# EAGLE board M8341D (EAGLE 6.6.0), part 1 of 2
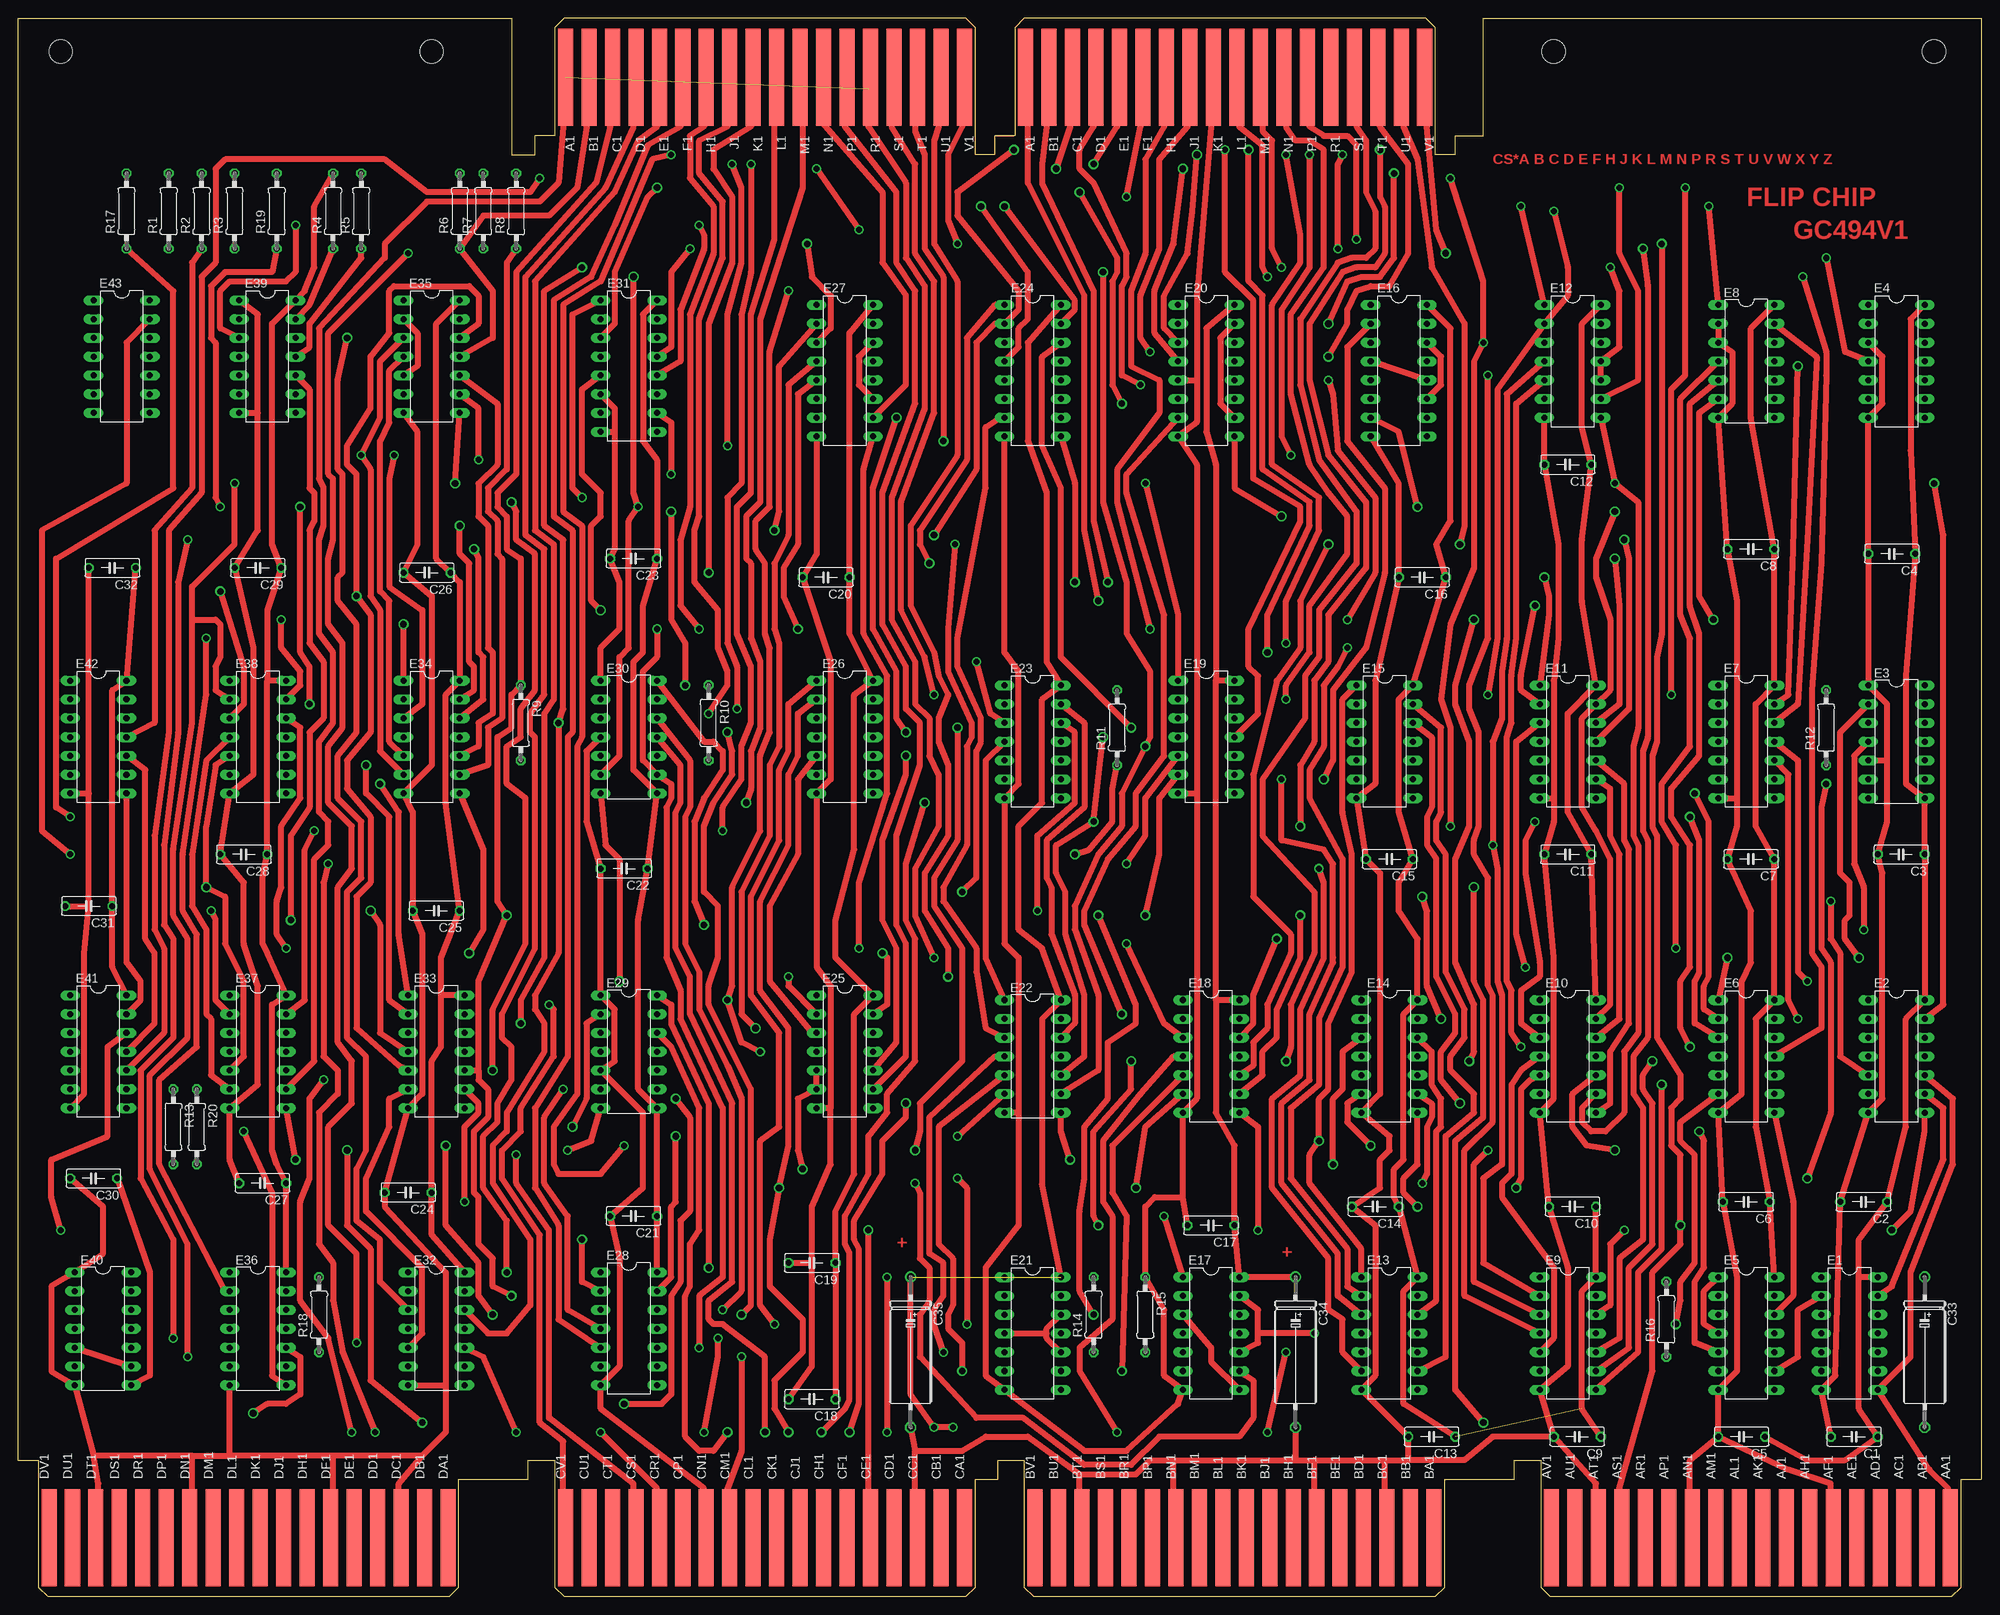
[diagram p4: board, top side]
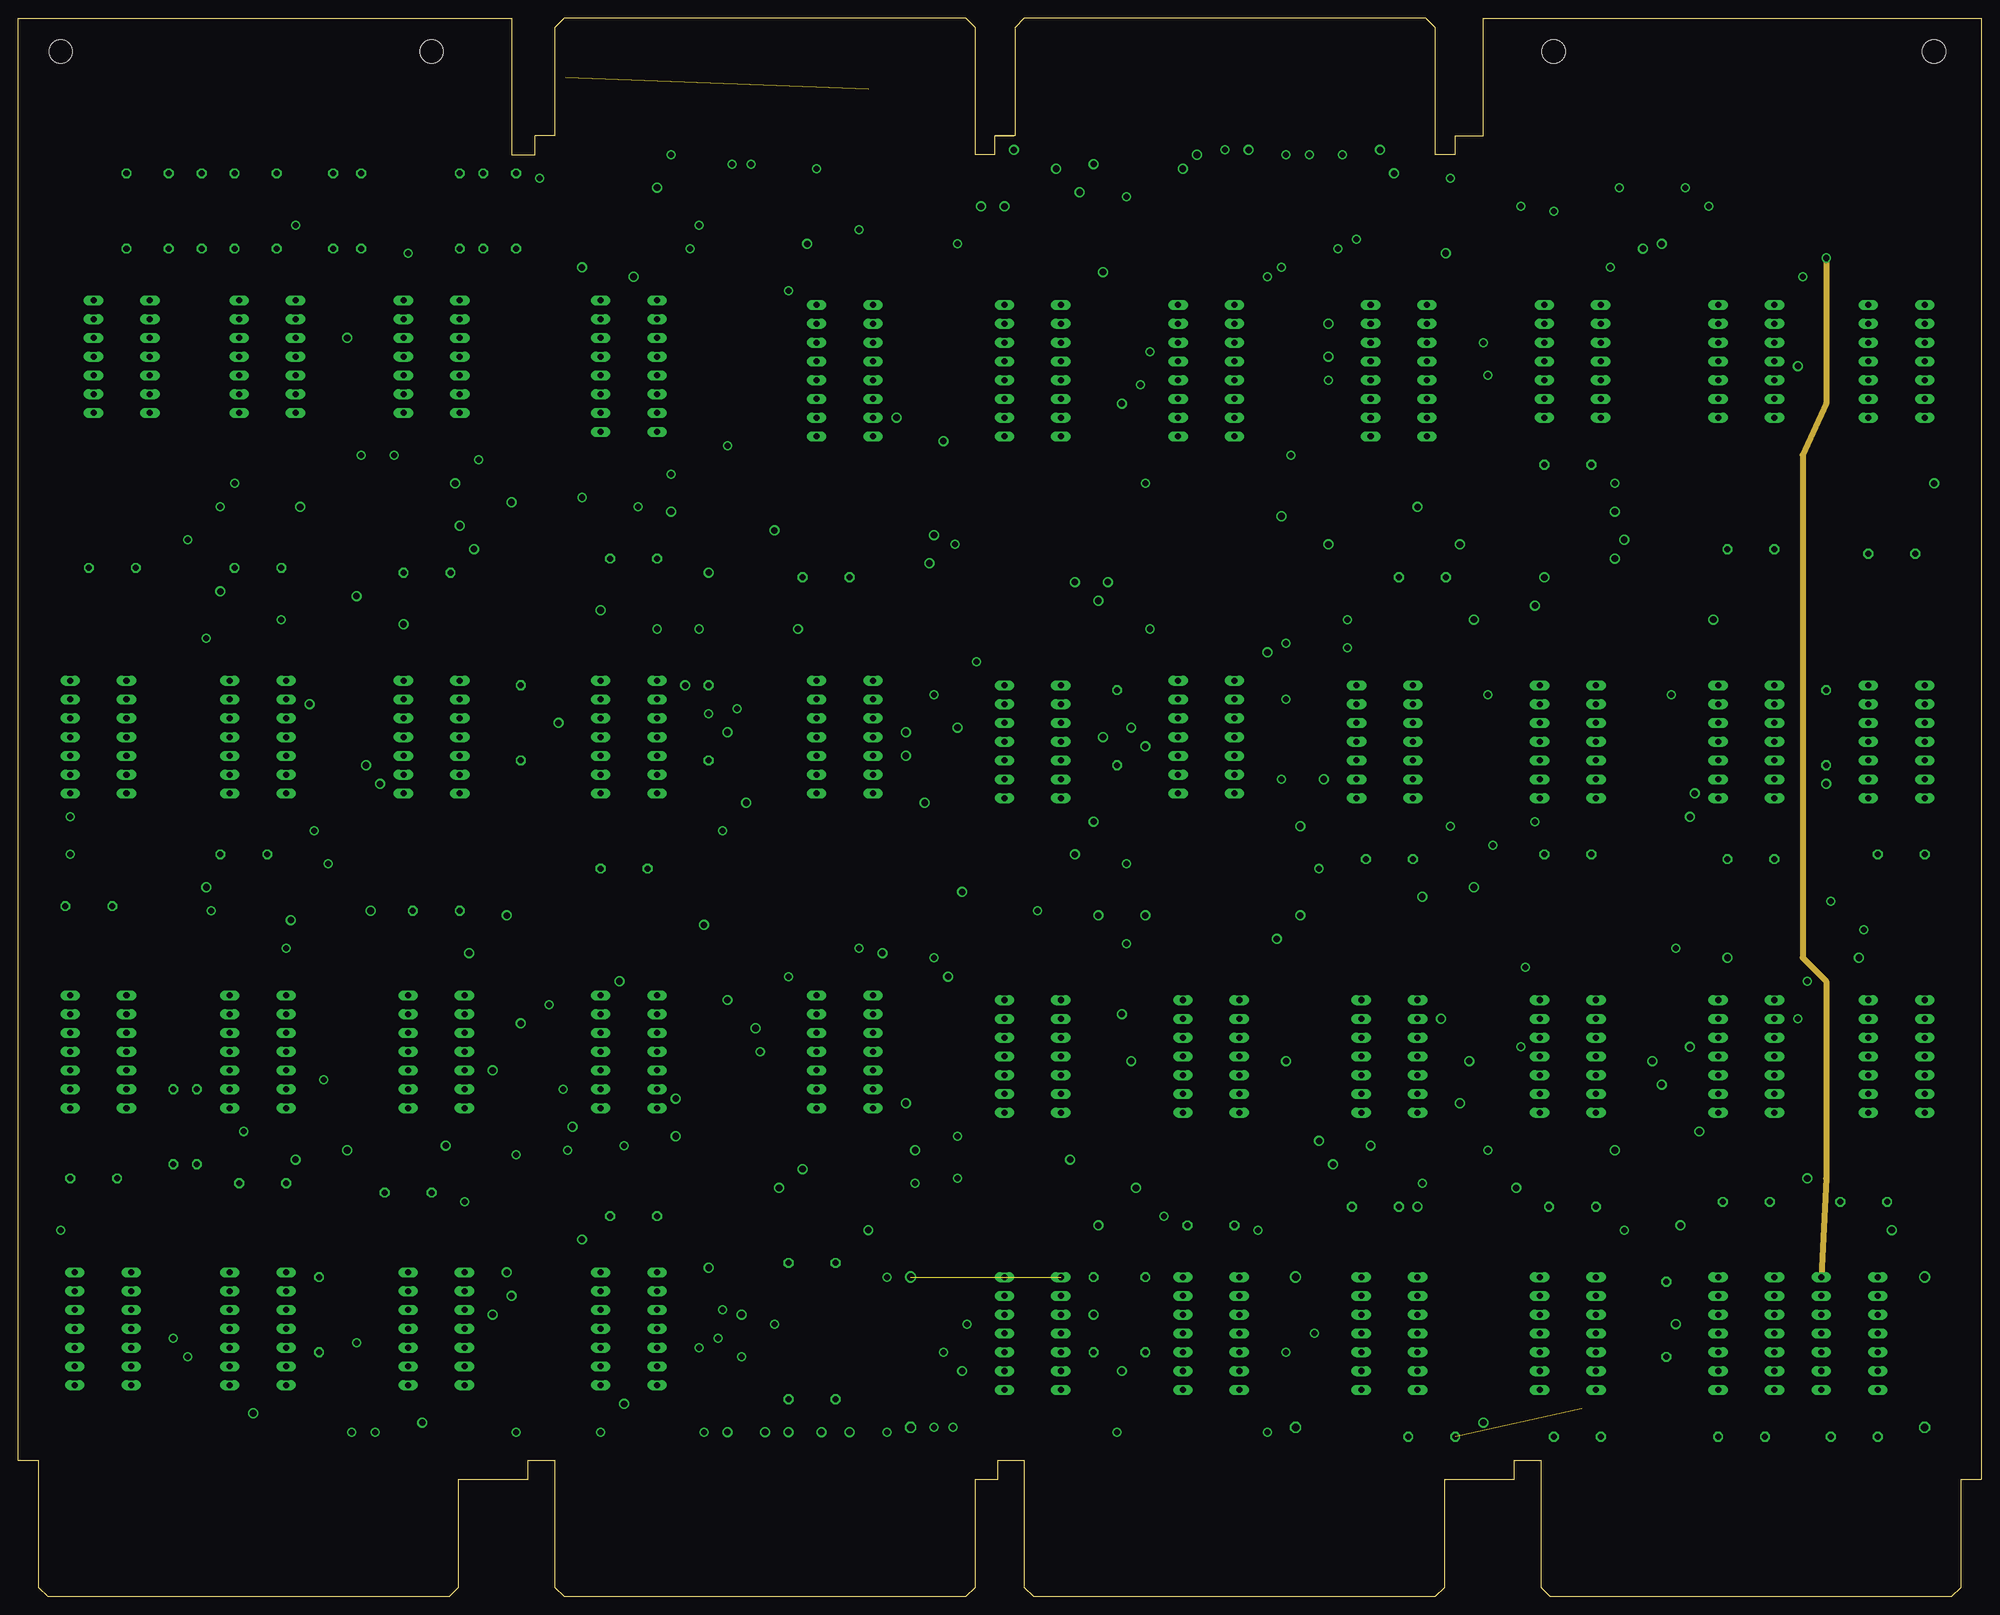
[diagram p5: board, inner layer ECO]
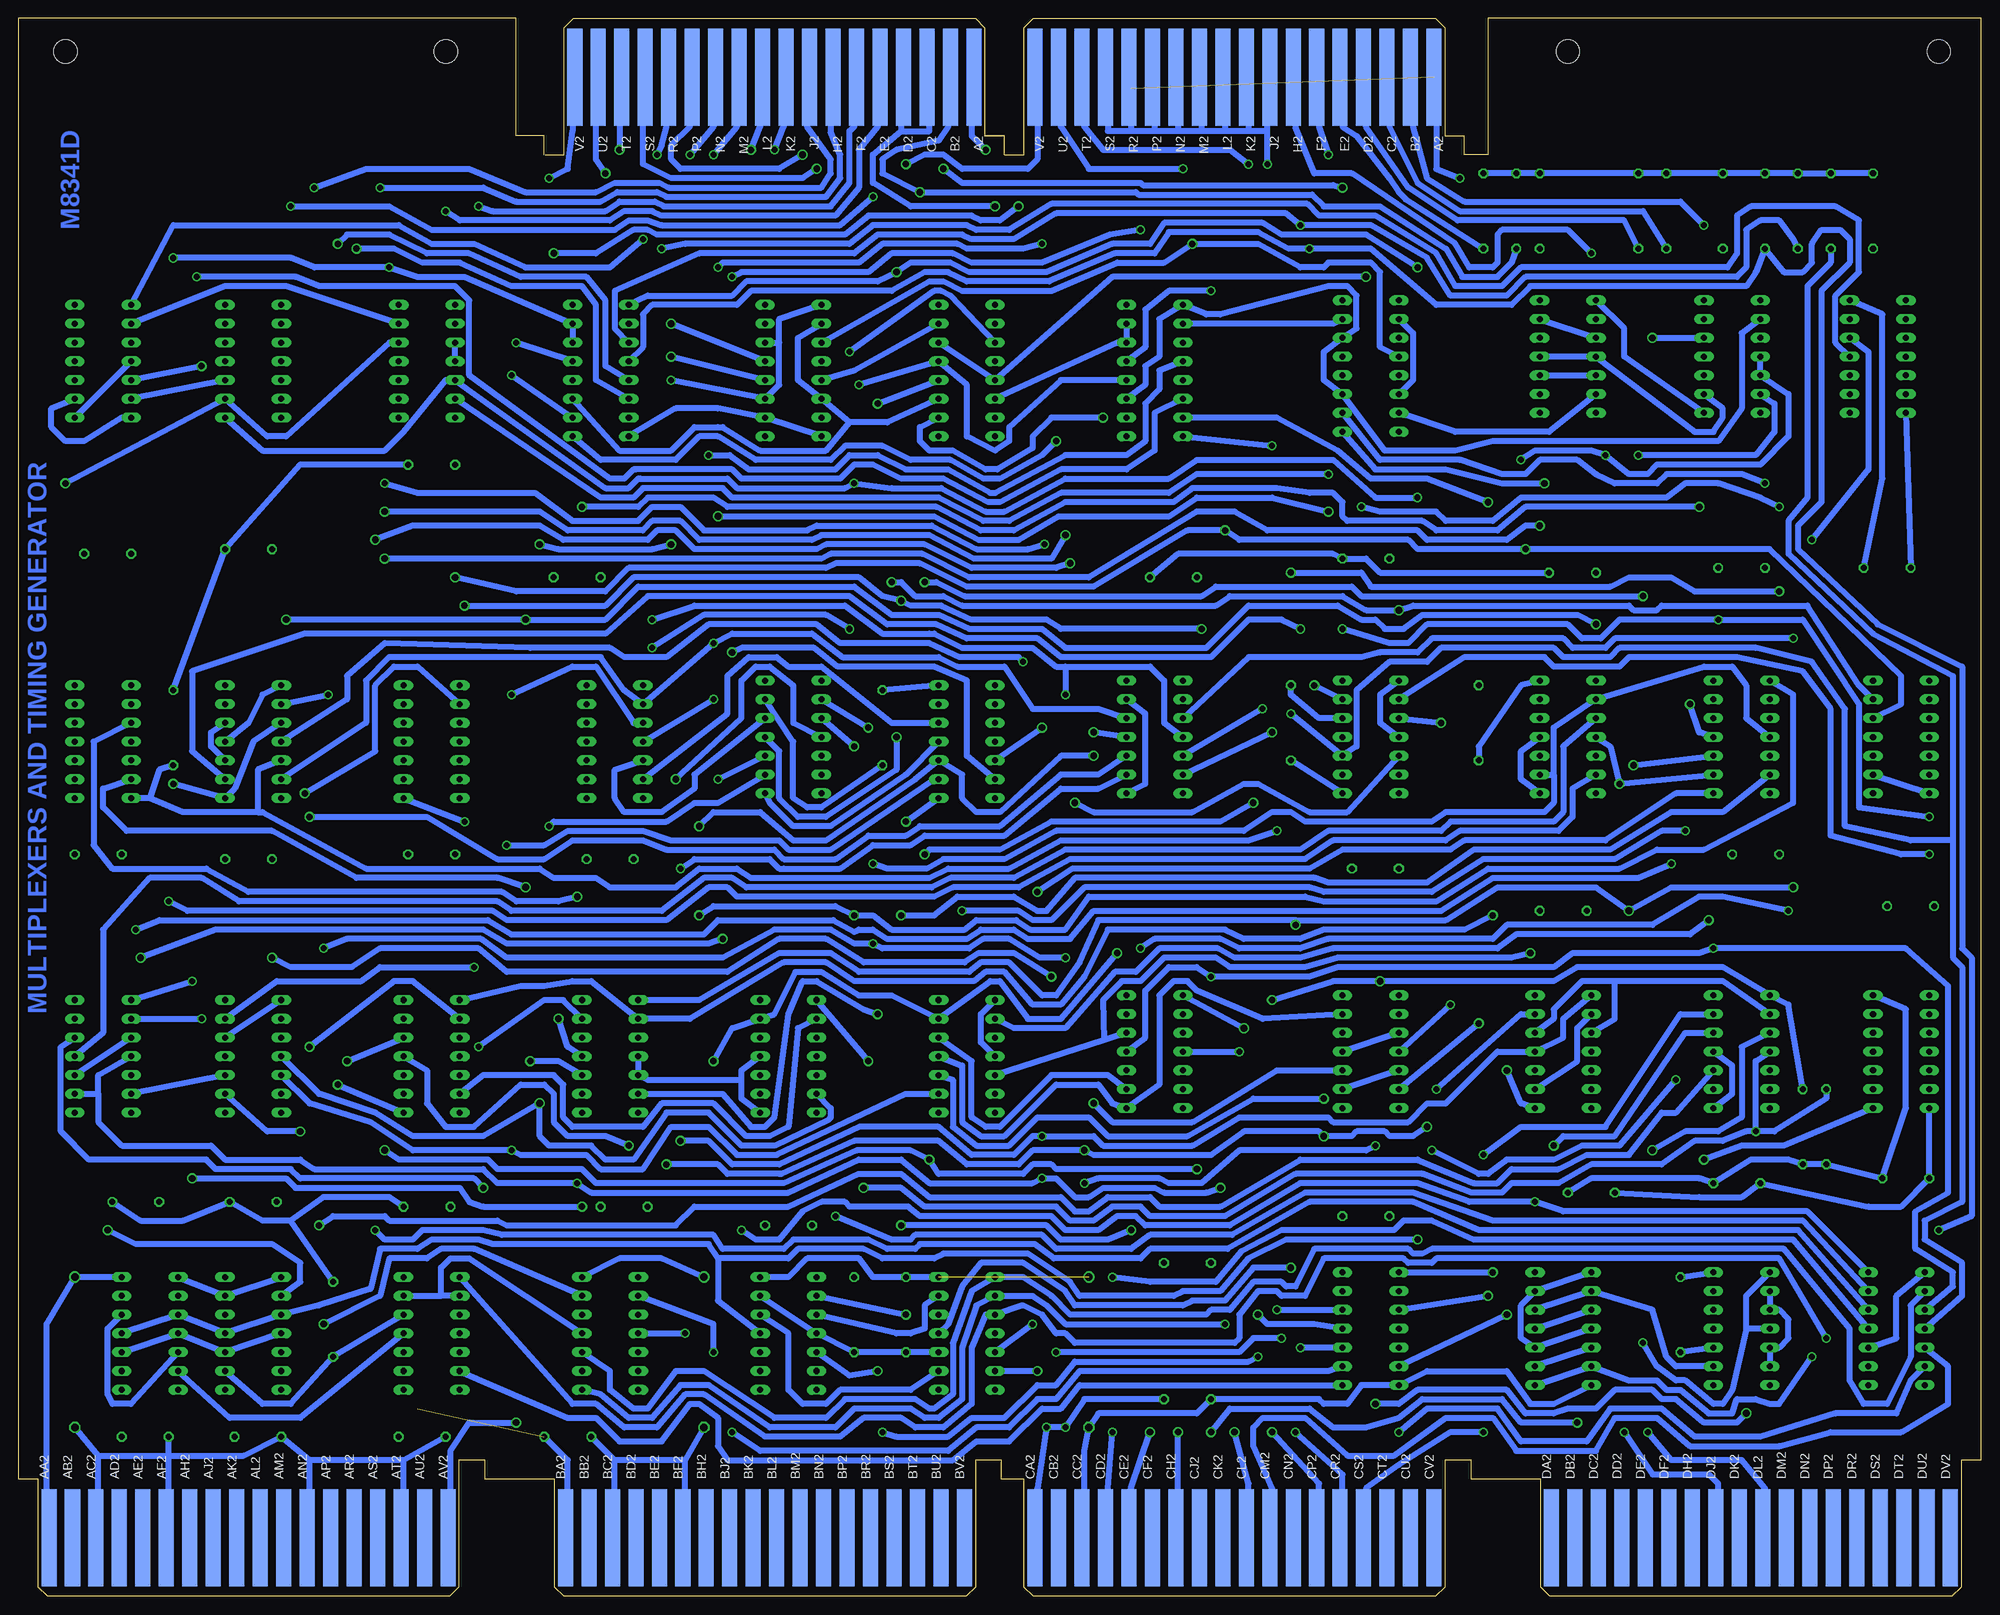
[diagram p6: board, bottom side, seen from below]

Size 265.43 x 213.36 mm. Coordinates in mm from the lower left corner, seen from the top.
Outline: 69.85,197.49 69.85,194.94 66.67,194.94 66.67,213.36 0,213.36 0,18.41 0.64,18.41
Outline: 265.43,15.88 265.43,213.36 198.12,213.36 198.12,197.49 194.31,197.49 194.31,194.94
Outline: 131.76,194.94 132.08,194.94 132.08,197.49 134.62,197.49
Copper layers (1+2+16): Top 0.035mm / dielectric 1.5mm / ECO 0.035mm / dielectric 0.15mm / Bottom 0.035mm
Design rules "16mils *": minimum track width 16mil, minimum drill 32mil, track to track 15mil, track to pad 10mil, pad to pad 10mil, via to via 10mil, smd to smd 10mil, copper to edge 13mil, drill to drill 10mil, minimum pad ring 10mil, minimum via ring 8mil, stop-mask expansion 0mil, vias tented up to drill 0mil, thermal gap 10mil
Net classes: 1 supply: width 0.813 mm
Holes 3.2 mm at 5.71,208.91 55.88,208.91 207.65,208.91 259.08,208.91

## Footprints (pad centres in the part's own frame; a part is rotated, then mirrored left to right if it is on the bottom)
C063-025X075 = drill 0.813 octagon: 1 -2.54,0; 2 3.81,0
E12-8 = drill 1.016: + -10.16,0 | drill 1.016 octagon: - 10.16,0
DIL14 = drill 0.813 long: 1 -7.62,-3.81; 2 -5.08,-3.81; 3 -2.54,-3.81; 4 0,-3.81; 5 2.54,-3.81; 6 5.08,-3.81; 7 7.62,-3.81; 8 7.62,3.81; 9 5.08,3.81; 10 2.54,3.81; 11 0,3.81; 12 -2.54,3.81; 13 -5.08,3.81; 14 -7.62,3.81
DIL16 = drill 0.813 long: 1 -8.89,-3.81; 2 -6.35,-3.81; 3 -3.81,-3.81; 4 -1.27,-3.81; 5 1.27,-3.81; 6 3.81,-3.81; 7 6.35,-3.81; 8 8.89,-3.81; 9 8.89,3.81; 10 6.35,3.81; 11 3.81,3.81; 12 1.27,3.81; 13 -1.27,3.81; 14 -3.81,3.81; 15 -6.35,3.81; 16 -8.89,3.81
EDGE-CON2 = smd 13.106 x 2.032: A1 7.938,4.128; B1 7.938,7.303; C1 7.938,10.477; D1 7.938,13.652; E1 7.938,16.828; F1 7.938,20.003; H1 7.938,23.177; J1 7.938,26.352; K1 7.938,29.527; L1 7.938,32.703; M1 7.938,35.877; N1 7.938,39.053; P1 7.938,42.227; R1 7.938,45.403; S1 7.938,48.578; T1 7.938,51.752; U1 7.938,54.928; V1 7.938,58.102 | smd 13.106 x 2.032 bottom: A2 7.938,4.128; B2 7.938,7.303; C2 7.938,10.477; D2 7.938,13.652; E2 7.938,16.828; F2 7.938,20.003; H2 7.938,23.177; J2 7.938,26.352; K2 7.938,29.527; L2 7.938,32.703; M2 7.938,35.877; N2 7.938,39.053; P2 7.938,42.227; R2 7.938,45.403; S2 7.938,48.578; T2 7.938,51.752; U2 7.938,54.928; V2 7.938,58.102
0207/10 = drill 0.813 octagon: 1 -5.08,0; 2 5.08,0
EDGE-CON8 = smd 2.032 x 13.106: AA1 261.303,7.938; AB1 258.127,7.938; AC1 254.952,7.938; AD1 251.778,7.938; AE1 248.602,7.938; AF1 245.428,7.938; AH1 242.252,7.938; AJ1 239.077,7.938; AK1 235.903,7.938; AL1 232.727,7.938; AM1 229.553,7.938; AN1 226.377,7.938; AP1 223.202,7.938; AR1 220.028,7.938; AS1 216.852,7.938; AT1 213.678,7.938; AU1 210.502,7.938; AV1 207.327,7.938; BA1 191.452,7.938; BB1 188.278,7.938; BC1 185.102,7.938; BD1 181.928,7.938; BE1 178.752,7.938; BF1 175.577,7.938; BH1 172.403,7.938; BJ1 169.227,7.938; BK1 166.053,7.938; BL1 162.877,7.938; BM1 159.702,7.938; BN1 156.528,7.938; BP1 153.352,7.938; BR1 150.178,7.938; BS1 147.002,7.938; BT1 143.827,7.938; BU1 140.653,7.938; BV1 137.477,7.938; CA1 127.953,7.938; CB1 124.778,7.938; CC1 121.603,7.938; CD1 118.427,7.938; CE1 115.252,7.938; CF1 112.078,7.938; CH1 108.903,7.938; CJ1 105.728,7.938; CK1 102.552,7.938; CL1 99.377,7.938; CM1 96.203,7.938; CN1 93.028,7.938; CP1 89.853,7.938; CR1 86.677,7.938; CS1 83.502,7.938; CT1 80.328,7.938; CU1 77.153,7.938; CV1 73.978,7.938; DA1 58.102,7.938; DB1 54.928,7.938; DC1 51.752,7.938; DD1 48.578,7.938; DE1 45.403,7.938; DF1 42.227,7.938; DH1 39.053,7.938; DJ1 35.877,7.938; DK1 32.703,7.938; DL1 29.527,7.938; DM1 26.352,7.938; DN1 23.177,7.938; DP1 20.003,7.938; DR1 16.828,7.938; DS1 13.652,7.938; DT1 10.477,7.938; DU1 7.303,7.938; DV1 4.128,7.938 | smd 2.032 x 13.106 bottom: AA2 261.303,7.938; AB2 258.127,7.938; AC2 254.952,7.938; AD2 251.778,7.938; AE2 248.602,7.938; AF2 245.428,7.938; AH2 242.252,7.938; AJ2 239.077,7.938; AK2 235.903,7.938; AL2 232.727,7.938; AM2 229.553,7.938; AN2 226.377,7.938; AP2 223.202,7.938; AR2 220.028,7.938; AS2 216.852,7.938; AT2 213.678,7.938; AU2 210.502,7.938; AV2 207.327,7.938; BA2 191.452,7.938; BB2 188.278,7.938; BC2 185.102,7.938; BD2 181.928,7.938; BE2 178.752,7.938; BF2 175.577,7.938; BH2 172.403,7.938; BJ2 169.227,7.938; BK2 166.053,7.938; BL2 162.877,7.938; BM2 159.702,7.938; BN2 156.528,7.938; BP2 153.352,7.938; BR2 150.178,7.938; BS2 147.002,7.938; BT2 143.827,7.938; BU2 140.653,7.938; BV2 137.477,7.938; CA2 127.953,7.938; CB2 124.778,7.938; CC2 121.603,7.938; CD2 118.427,7.938; CE2 115.252,7.938; CF2 112.078,7.938; CH2 108.903,7.938; CJ2 105.728,7.938; CK2 102.552,7.938; CL2 99.377,7.938; CM2 96.203,7.938; CN2 93.028,7.938; CP2 89.853,7.938; CR2 86.677,7.938; CS2 83.502,7.938; CT2 80.328,7.938; CU2 77.153,7.938; CV2 73.978,7.938; DA2 58.102,7.938; DB2 54.928,7.938; DC2 51.752,7.938; DD2 48.578,7.938; DE2 45.403,7.938; DF2 42.227,7.938; DH2 39.053,7.938; DJ2 35.877,7.938; DK2 32.703,7.938; DL2 29.527,7.938; DM2 26.352,7.938; DN2 23.177,7.938; DP2 20.003,7.938; DR2 16.828,7.938; DS2 13.652,7.938; DT2 10.477,7.938; DU2 7.303,7.938; DV2 4.128,7.938

## Placement (x,y rotation side)
C1  .01uF  [C063-025X075]  248.92,21.59 180 top
C2  .01uF  [C063-025X075]  250.19,53.34 180 top
C3  .01uF  [C063-025X075]  255.27,100.33 180 top
C4  .01uF  [C063-025X075]  254,140.97 180 top
C5  .01uF  [C063-025X075]  233.68,21.59 180 top
C6  .01uF  [C063-025X075]  234.31,53.34 180 top
C7  .01uF  [C063-025X075]  234.95,99.69 180 top
C8  .01uF  [C063-025X075]  234.95,141.6 180 top
C9  .01uF  [C063-025X075]  211.46,21.59 180 top
C10  .01uF  [C063-025X075]  210.82,52.7 180 top
C11  .01uF  [C063-025X075]  210.19,100.33 180 top
C12  .01uF  [C063-025X075]  210.19,153.03 180 top
C13  .01uF  [C063-025X075]  191.77,21.59 180 top
C14  .01uF  [C063-025X075]  184.15,52.7 180 top
C15  .01uF  [C063-025X075]  186.06,99.69 180 top
C16  .01uF  [C063-025X075]  190.5,137.79 180 top
C17  .01uF  [C063-025X075]  161.93,50.16 180 top
C18  .01uF  [C063-025X075]  107.95,26.67 180 top
C19  .01uF  [C063-025X075]  107.95,45.09 180 top
C20  .01uF  [C063-025X075]  109.86,137.79 180 top
C21  .01uF  [C063-025X075]  83.82,51.44 180 top
C22  .01uF  [C063-025X075]  82.55,98.42 180 top
C23  .01uF  [C063-025X075]  83.82,140.34 180 top
C24  .01uF  [C063-025X075]  53.34,54.61 180 top
C25  .01uF  [C063-025X075]  57.15,92.71 180 top
C26  .01uF  [C063-025X075]  55.88,138.43 180 top
C27  .01uF  [C063-025X075]  33.66,55.88 180 top
C28  .01uF  [C063-025X075]  31.11,100.33 180 top
C29  .01uF  [C063-025X075]  33.02,139.06 180 top
C30  .01uF  [C063-025X075]  10.79,56.52 180 top
C31  .01uF  [C063-025X075]  10.16,93.34 180 top
C32  .01uF  [C063-025X075]  13.34,139.06 180 top
C33  6.8uF  [E12-8]  257.81,33.02 270 top
C34  6.8uF  [E12-8]  172.72,33.02 270 top
C35  6.8uF  [E12-8]  120.65,33.02 270 top
E1  74H74N  [DIL14]  247.65,35.56 270 top
E2  7410N  [DIL14]  254,73.03 270 top
E3  SP380N  [DIL14]  254,115.57 270 top
E4  7404N  [DIL14]  254,167 270 top
E5  74H74N  [DIL14]  233.68,35.56 270 top
E6  7400N  [DIL14]  233.68,73.03 270 top
E7  7402N  [DIL14]  233.68,115.57 270 top
E8  74H53N  [DIL14]  233.68,167 270 top
E9  7402N  [DIL14]  209.55,35.56 270 top
E10  7404N  [DIL14]  209.55,73.03 270 top
E11  7486N  [DIL14]  209.55,115.57 270 top
E12  74H11N  [DIL14]  210.19,167 270 top
E13  74H74N  [DIL14]  185.42,35.56 270 top
E14  7410N  [DIL14]  185.42,73.03 270 top
E15  7412N  [DIL14]  184.78,115.57 270 top
E16  DEC8235  [DIL16]  186.69,165.74 270 top
E17  74H74N  [DIL14]  161.29,35.56 270 top
E18  sn97401  [DIL14]  161.29,73.03 270 top
E19  7404N  [DIL14]  160.66,116.2 270 top
E20  DEC8235  [DIL16]  160.66,165.74 270 top
E21  74H74N  [DIL14]  137.16,35.56 270 top
E22  N8881N  [DIL14]  137.16,73.03 270 top
E23  7416N  [DIL14]  137.16,115.57 270 top
E24  DEC8235  [DIL16]  137.16,165.74 270 top
E25  sn97401  [DIL14]  111.76,73.66 270 top
E26  7486N  [DIL14]  111.76,116.2 270 top
E27  DEC8235  [DIL16]  111.76,165.74 270 top
E28  7404N  [DIL14]  82.55,36.2 270 top
E29  SP380N  [DIL14]  82.55,73.66 270 top
E30  SP384N  [DIL14]  82.55,116.2 270 top
E31  DEC8235  [DIL16]  82.55,166.37 270 top
E32  N8881N  [DIL14]  56.52,36.2 270 top
E33  7410N  [DIL14]  56.52,73.66 270 top
E34  7402N  [DIL14]  55.88,116.2 270 top
E35  7410N  [DIL14]  55.88,167.64 270 top
E36  N8881N  [DIL14]  32.38,36.2 270 top
E37  sn97401  [DIL14]  32.38,73.66 270 top
E38  7400N  [DIL14]  32.38,116.2 270 top
E39  7404N  [DIL14]  33.66,167.64 270 top
E40  SP380N  [DIL14]  11.43,36.2 270 top
E41  74H74N  [DIL14]  10.79,73.66 270 top
E42  7404N  [DIL14]  10.79,116.2 270 top
E43  DM8093  [DIL14]  13.97,167.64 270 top
F  EDGE-TOP  [EDGE-CON2]  132.08,213.36 270 top
H  EDGE-TOP  [EDGE-CON2]  69.85,213.36 270 top
R1  750  [0207/10]  20.32,187.32 90 top
R2  470  [0207/10]  24.77,187.32 90 top
R3  470  [0207/10]  29.21,187.32 90 top
R4  470  [0207/10]  42.55,187.32 90 top
R5  470  [0207/10]  46.35,187.32 90 top
R6  1K  [0207/10]  59.69,187.32 90 top
R7  470  [0207/10]  62.87,187.32 90 top
R8  1K  [0207/10]  67.31,187.32 90 top
R9  1K  [0207/10]  67.94,118.11 270 top
R10  470  [0207/10]  93.34,118.11 270 top
R11  470  [0207/10]  148.59,117.47 90 top
R12  470  [0207/10]  244.47,117.47 90 top
R13  470  [0207/10]  20.95,63.5 270 top
R14  470  [0207/10]  145.41,38.1 90 top
R15  1K  [0207/10]  152.4,38.1 270 top
R16  470  [0207/10]  222.88,37.47 90 top
R17  750  [0207/10]  14.61,187.32 90 top
R18  470  [0207/10]  40.64,38.1 90 top
R19  470  [0207/10]  34.92,187.32 90 top
R20  470  [0207/10]  24.13,63.5 270 top
U$2  QUAD  [EDGE-CON8]  0,0 0 top

## Tracks (layer width: path | path; a pad name or v marks a point on that pad's centre or on a via)
!(ASR+LSR)*EAE_ON
  Bottom 0.813: E35.6 58.42,157.48 71.12,157.48 E31.7
!(SHL+NORMS)*EAE_ON  (via drill 0.9 pad 0.3)
  Top 0.813: E24.9 142.88,150.5 v142.88,137.16 | E35.12 62.23,172.09 62.23,175.9 60.96,177.16 50.8,177.16 50.16,176.53 50.16,170.81 47.62,167.64 47.62,160.66 44.45,155.57 44.45,153.03 45.72,151.76 v45.72,135.25 47.62,132.72 47.62,116.84 44.45,113.03 44.45,109.22 47.62,105.41 47.62,96.52 45.72,94.61 45.72,76.83 51.44,71.75 E33.5
  Bottom 0.813: v142.88,137.16 141.29,137.16 137.48,135.25 105.41,135.25 103.5,136.53 85.09,136.53 83.82,135.25 v45.72,135.25
!AC_LOAD  (via drill 0.81, 0.9 pad 0.3)
  Top 0.813: E19.11 167.64,119.38 167.64,124.46 166.37,125.73 166.37,130.81 173.35,145.41 173.35,147.32 167,151.13 167,175.26 163.19,179.07 v163.19,195.58 | E36.10 38.1,32.38 38.1,27.3 36.2,26.04 33.66,26.04 v31.75,24.77 | v88.9,67.31 90.81,64.77 90.81,52.07 89.53,50.8 89.53,42.55 88.27,40.64 88.27,27.3 87,26.04 v81.92,26.04 | E22.10 144.15,73.03 144.15,81.28 141.6,89.53 141.6,95.25 140.34,97.79 140.34,101.6 v145.41,104.78 v146.69,116.2
  Bottom 0.813: E36.10 R18.1 | v163.19,195.58 161.93,198.75 161.93,205.1 F.K2 | E22.10 139.06,69.85 139.06,63.5 135.89,60.96 131.44,60.96 127.64,64.77 120.65,64.77 118.11,62.23 107.31,62.23 98.42,67.31 v88.9,67.31 | v145.41,104.78 E23.8 | v146.69,116.2 146.69,111.76 156.21,105.41 160.02,105.41 162.56,107.95 162.56,114.3 E19.11 | v31.75,24.77 33.02,23.5 37.47,23.5 41.27,26.67 43.18,26.67 44.45,27.94 49.53,27.94 52.07,25.4 55.88,25.4 57.78,24.77 61.59,24.77 64.14,27.94 76.2,27.94 78.74,26.04 v81.92,26.04
!AC_TO_BUS  (via drill 0.9 pad 0.3)
  Top 0.813: F.U1 187.32,205.1 187.32,198.75 189.23,194.31 191.13,179.71 195.58,172.09 195.58,144.78 v194.94,142.24 | v177.16,142.24 173.35,134.62 173.35,128.27 170.18,123.83 167,111.12 167,94.61 172.09,89.53 172.09,87 168.91,80.01 168.91,76.83 167,74.93 167,71.75 E18.10
  Bottom 0.813: v194.94,142.24 192.41,141.6 179.71,141.6 v177.16,142.24
!AC_TO_MQ_ENA  (via drill 0.9 pad 0.3)
  Top 0.813: v168.91,127.64 168.91,132.72 174.62,144.78 174.62,147.96 168.28,152.4 168.28,175.9 166.37,177.8 v166.37,195.58
  Bottom 0.813: E23.6 137.16,113.67 137.16,123.83 141.6,125.73 154.62,125.73 157.8,128.27 167.64,128.27 v168.91,127.64 | v166.37,195.58 165.1,198.75 165.1,205.1 F.L2
!AD0  (via drill 0.81)
  Top 0.813: v168.91,22.23 v171.45,33.02 | F.H1 154.94,204.47 154.94,198.75 152.4,194.31 152.4,181.61 150.5,176.53 150.5,166.37 154.31,164.47 154.31,160.02 148.59,152.4 148.59,147.96 v153.03,130.81 | v179.71,128.27 178.44,125.73 176.53,123.19 176.53,114.94 174.62,111.76 174.62,107.95 179.07,99.69 179.07,85.09 175.9,78.11 175.9,69.22 172.09,66.04 172.09,56.52 179.71,46.99 179.71,41.91 E13.2
  Bottom 0.813: E28.9 88.27,30.48 121.92,30.48 125.09,26.67 127.64,26.67 131.44,22.86 135.89,22.86 139.7,19.68 165.1,19.68 v168.91,22.23 | v171.45,33.02 171.45,36.83 E13.2 | v153.03,130.81 156.21,132.72 172.72,132.72 v179.71,128.27
!AD_LK  (via drill 0.81)
  Top 0.813: v153.03,168.28 151.76,170.18 151.76,175.9 154.31,182.25 154.31,194.31 158.12,198.75 158.12,205.1 F.J1
  Bottom 0.813: E24.3 139.38,175.9 140.65,176.53 141.6,176.53 v153.03,168.28
!ADLK_DIS  (via drill 0.9 pad 0.3)
  Top 0.813: v145.41,193.68 148.59,198.75 148.59,205.1 F.E1
  Bottom 0.813: H.V2 127.64,204.47 127.64,194.31 128.91,193.04 137.79,193.04 140.34,194.94 142.88,194.94 v145.41,193.68
!CARRY_OUT  (via drill 0.81)
  Top 0.813: v171.45,128.91 171.45,134.62 175.9,144.15 175.9,148.59 169.54,153.03 169.54,174.62 173.35,180.34 173.35,184.15 v171.45,194.94
  Bottom 0.813: v171.45,194.94 168.28,198.75 168.28,205.42 F.M2 | E26.12 119.38,120.02 128.27,120.02 132.08,125.73 138.43,125.73 140.97,127 153.99,127 158.12,130.18 168.91,130.18 v171.45,128.91 E15.2 183.51,122.56 186.69,127 215.26,127 218.44,123.83 218.44,118.11 E7.6
!CLOCK  (via drill 0.9 pad 0.3)
  Top 0.813: E28.2 76.2,42.55 v76.2,48.26
  Bottom 0.813: E1.11 E1.3 E5.11 E5.3 224.79,39.37 217.81,41.59 216.53,46.99 211.46,46.99 209.55,48.26 203.2,48.26 201.29,47.62 172.09,47.62 170.81,45.72 | v76.2,48.26 93.98,48.26 99.06,45.72 102.87,41.27 107.95,41.27 109.22,40.64 121.92,40.64 123.19,42.55 128.91,46.35 140.34,46.35 141.6,45.72 148.59,45.72 151.13,46.99 160.02,46.99 161.29,45.72 170.81,45.72 | 170.81,45.72 170.81,40.01 E17.11
!DAD+DST  (via drill 0.9 pad 0.3)
  Top 0.813: H.E1 86.36,204.47 86.36,198.75 83.82,196.85 80.64,189.87 69.85,177.8 69.85,144.15 72.39,142.24 72.39,121.28 71.12,119.38 71.12,86.36 67.94,80.64 v67.94,77.47
  Bottom 0.813: v67.94,77.47 E29.6
!DCM+DPIC  (via drill 0.9 pad 0.3)
  Top 0.813: E30.14 92.71,115.57 93.98,115.57 95.25,114.3 95.25,111.76 92.71,107.95 91.44,104.78 91.44,93.98 v92.71,90.81 | v47.62,92.71 48.9,90.81 48.9,76.2 E33.4 | E38.5 26.67,112.39 25.4,104.14 v25.4,95.89 27.94,94.61 27.94,88.27 30.48,83.19 30.48,73.03 E37.5
  Bottom 0.813: 92.71,91.44 119.38,91.44 121.92,85.72 125.09,81.28 127,81.28 131.44,85.72 135.25,85.72 136.84,84.45 151.76,84.45 155.57,87 162.56,87 173.35,80.64 E14.1 | v92.71,90.81 92.71,91.44 | 92.71,91.44 72.39,91.44 65.41,95.89 52.07,95.89 v47.62,92.71 41.91,95.89 v25.4,95.89
!EAE_ON  (via drill 0.9 pad 0.3)
  Top 0.813: E22.5 124.46,63.5 124.46,47.62 126.36,45.72 126.36,39.37 125.73,38.1 125.73,36.2 127.64,34.29 v127.64,30.48 | E34.8 62.87,100.97 62.87,90.17 v60.96,87
  Bottom 0.813: E34.8 62.23,110.49 62.23,114.3 E34.11 | E25.12 118.63,75.22 | 118.63,75.22 E22.5 | v60.96,87 63.5,86.36 87,86.36 91.44,85.09 101.6,85.09 103.5,86.36 110.49,86.36 113.67,83.19 116.2,83.19 118.75,80.64 118.63,75.22 | v127.64,30.48 E21.6
!FETCH  (via drill 0.9 pad 0.3)
  Top 0.813: v192.41,78.11 190.5,82.55 190.5,92.71 v189.87,94.61
  Bottom 0.813: E14.11 191.13,74.3 v192.41,78.11 | v189.87,94.61 192.41,93.98 198.12,93.98 200.03,95.25 234.31,95.25 240.03,98.42 252.73,98.42 255.27,101.6 255.27,115.57 E3.3
!INIT
  Bottom 0.813: E40.2 9.53,39.37 9.53,32.38 12.7,26.04 15.88,26.04 17.78,29.21 17.78,36.2 26.67,46.99 74.3,46.99 75.56,46.35 76.83,46.35 77.47,46.99 90.17,46.99 92.71,41.91 93.98,41.91 94.61,42.55 98.42,42.55 101.6,38.73 104.14,38.73 104.78,38.1 123.19,38.1 125.73,40.64 129.54,43.18 E21.1 136.53,41.27 139.06,34.29 139.06,27.3 141.6,25.4 142.24,25.4 144.15,26.67 153.67,26.67 156.21,24.13 163.19,24.13 172.72,30.48 176.53,30.48 180.34,25.4 182.25,25.4 185.42,27.94 185.42,30.48 E13.10
!LAST_DVI  (via drill 0.81)
  Top 0.813: E37.2 26.67,80.64 26.67,91.44 v26.04,92.71 | v113.67,87.63 113.67,96.52 117.47,108.58 117.47,124.46 114.3,130.18 114.3,152.4 E27.9
  Bottom 0.813: E33.3 49.53,78.11 49.53,83.19 | 49.53,83.19 53.98,83.19 57.78,79.38 57.78,78.11 E33.12 | E37.2 34.92,83.19 49.53,83.19 | v26.04,92.71 34.92,94.61 38.1,94.61 44.45,90.81 64.14,90.81 66.04,88.9 88.27,88.9 92.08,87.63 100.33,87.63 102.87,88.9 111.76,88.9 v113.67,87.63
!LEFT  (via drill 0.81)
  Top 0.813: v151.76,163.83 149.22,165.1 149.22,177.16 149.86,178.44 149.86,181.61 145.41,191.13 143.51,193.04 143.51,195.58 145.41,198.75 145.41,204.47 F.D1
  Bottom 0.813: E27.12 124.46,164.47 131.44,158.12 131.44,156.21 133.35,154.94 137.16,156.84 137.16,163.83 E24.13 v151.76,163.83
!MQ0  (via drill 0.9 pad 0.3)
  Top 0.813: v134.62,195.58 127,189.87 127,186.69 135.25,176.53 135.25,173.99 E24.2 132.08,172.09 129.54,169.54 129.54,152.4 v123.83,143.51 | v215.9,146.69 213.36,140.34 213.36,137.79 215.26,132.08 215.26,122.56 E11.13 211.46,118.75 211.46,106.68 213.36,103.5 215.26,99.69 215.26,80.01 E10.13
  Bottom 0.813: F.A2 136.53,203.2 136.53,197.49 v134.62,195.58 | v123.83,143.51 125.73,140.34 136.21,140.34 142.24,143.51 156.84,143.51 158.12,142.88 173.35,142.88 175.9,145.41 179.71,145.41 180.97,144.15 191.13,144.15 194.94,146.69 v215.9,146.69
!MQ10  (via drill 0.9 pad 0.3)
  Top 0.813: E27.5 105.41,162.56 105.41,142.24 103.5,139.06 103.5,135.25 v105.41,130.81 | v146.05,134.62 144.15,144.15 144.15,175.9 136.53,191.13 136.53,204.47 F.A1 | E11.2 203.2,122.56 203.2,124.46 v205.1,133.99 | E6.2 227.97,79.38 227.97,82.55 228.6,83.82 228.6,104.78 v226.69,108.58
  Bottom 0.813: v105.41,130.81 124.46,130.81 126.36,132.08 136.53,132.08 140.65,133.99 144.78,133.99 v146.05,134.62 148.59,135.25 151.76,137.79 182.25,137.79 186.06,133.99 v205.1,133.99 | v226.69,108.58 217.17,114.3 217.17,123.19 214.63,125.73 211.46,125.73 E11.2
!MQ11  (via drill 0.9 pad 0.3)
  Top 0.813: F.B1 139.06,204.47 139.06,198.75 138.43,193.68 138.43,191.13 145.41,176.53 145.41,145.41 v147.32,137.16 | E31.5 76.2,163.19 76.2,151.76 78.74,149.22 78.74,146.05 77.47,144.78 77.47,134.62 v78.74,133.35
  Bottom 0.813: v147.32,137.16 146.05,137.16 144.15,135.25 140.34,135.25 137.79,133.99 103.5,133.99 101.6,135.25 86.36,135.25 83.19,133.35 v78.74,133.35 76.83,133.99 47.62,133.99 46.99,133.35 43.81,133.35 43.18,133.99 23.5,133.99 16.51,123.19 E42.13
!MQ_DATA  (via drill 0.9 pad 0.3)
  Top 0.813: v143.51,189.87 148.59,180.97 148.59,179.07 147.96,177.8 147.96,163.83 v149.22,161.29
  Bottom 0.813: F.B2 139.7,203.84 139.7,198.75 140.97,196.85 146.69,195.58 148.59,194.31 148.59,192.41 v143.51,189.87 114.3,189.87 113.98,189.55 90.49,189.55 88.9,187.96 81.28,187.96 72.39,182.25 70.17,178.44 65.41,178.44 63.5,180.34 R7.1 | v149.22,161.29 E24.12
!MQ_TO_BUS  (via drill 0.9 pad 0.3)
  Top 0.813: E20.4 153.67,170.81 153.67,176.53 156.21,182.88 v157.48,193.04
  Bottom 0.813: v157.48,193.04 159.38,191.77 177.16,191.77 180.97,193.68 180.97,205.1 F.S2
!MUY*EAE_ON  (via drill 0.9 pad 0.3)
  Top 0.813: v59.05,150.5 E35.8
  Bottom 0.813: E31.9 81.92,152.4 72.39,152.4 64.77,150.5 v59.05,150.5
!NORMAL_DVI  (via drill 0.9, 0.9 pad 0.3)
  Top 0.813: v64.14,71.12 64.14,79.38 68.58,88.27 68.58,107.95 66.04,109.86 66.04,114.94 67.94,116.2 67.94,120.02 69.85,122.56 69.85,140.97 67.31,142.88 67.31,146.69 v66.67,147.96
  Bottom 0.813: E33.8 62.23,66.67 v64.14,71.12 | v66.67,147.96 74.93,151.13 82.55,151.13 87,154.94 95.25,159.38 E27.7
!RIGHT  (via drill 0.9 pad 0.3)
  Top 0.813: F.C1 142.24,203.84 142.24,198.75 v140.34,193.04 | v86.36,190.5 85.09,189.23 80.64,179.07 80.64,172.09 E31.3
  Bottom 0.813: v140.34,193.04 137.79,191.13 113.67,191.13 113.35,190.82 87.63,190.82 v86.36,190.5
!SAM  (via drill 0.9 pad 0.3)
  Top 0.813: v39.37,120.65 39.37,125.73 38.1,127.64 v38.1,147.32 | v189.23,147.32 186.69,157.48 E16.7
  Bottom 0.813: E38.11 38.1,116.84 v39.37,120.65 | v38.1,147.32 61.59,147.32 65.41,144.15 73.66,144.15 75.56,145.41 85.72,145.41 86.36,146.05 86.36,147.96 87.63,149.22 90.81,149.22 95.25,149.86 106.68,149.86 109.22,147.96 123.83,147.96 130.81,144.15 135.25,144.15 141.29,147.32 169.54,147.32 171.45,148.59 180.34,148.59 181.61,147.32 v189.23,147.32
!SC_0  (via drill 0.9 pad 0.3)
  Top 0.813: H.U1 124.46,204.47 124.46,198.75 123.83,196.85 123.83,182.88 127,177.8 127,154.31 120.65,144.78 120.65,133.99 123.83,127.64 124.46,124.46 125.73,121.92 124.46,118.75 124.46,115.57 125.73,112.39 125.73,102.87 122.56,97.79 122.56,92.71 125.73,87.63 v125.73,83.82 | v231.14,86.36 E6.1
  Bottom 0.813: E6.1 E6.12 | v125.73,83.82 130.81,87 135.57,87 137.48,85.72 151.13,85.72 156.21,88.9 162.56,88.9 169.54,84.45 199.39,84.45 203.2,87.63 216.53,87.63 220.34,85.09 228.6,85.09 v231.14,86.36
!SGT
  Top 0.813: H.F1 89.53,204.47 89.53,198.75 85.09,196.22 80.64,185.42 77.47,178.44 72.39,175.26 72.39,146.05 74.93,144.15 74.93,116.84 74.3,116.2 74.3,73.03 69.85,66.04 69.85,55.24 73.03,50.16 73.03,37.47 E28.5
!SHL_ENA  (via drill 0.9 pad 0.3)
  Top 0.813: E24.4 135.25,168.91 135.25,171.45 136.53,172.72 136.53,179.07 v130.18,187.96 | v193.04,181.61 191.77,184.78 190.5,198.75 190.5,204.47 F.V1
  Bottom 0.813: v130.18,187.96 132.72,186.06 135.25,186.06 136.53,186.69 150.5,186.69 153.67,184.15 179.07,184.15 180.34,184.78 182.25,184.78 187.32,181.61 v193.04,181.61
!TS3  (via drill 0.81, 0.9 pad 0.3)
  Top 0.813: v60.33,53.34 60.33,63.5 62.23,65.41 62.23,66.67 E33.9 | E18.8 167.64,63.5 v167.64,49.53 | E33.2 50.16,80.64 50.16,105.41 46.99,108.58 v46.99,112.39
  Bottom 0.813: E40.14 23.5,52.07 56.52,52.07 v60.33,53.34 69.22,53.34 76.2,55.88 92.08,55.88 101.6,50.16 113.03,50.16 114.3,51.44 116.84,51.44 119.38,49.53 123.83,49.53 125.73,51.44 143.51,51.44 145.1,52.7 153.03,52.7 153.67,53.34 156.84,53.34 159.38,52.07 162.56,48.26 165.74,48.26 v167.64,49.53 | E18.8 167.64,67.31 167.64,69.85 | 167.64,69.85 167.64,71.12 E18.11 | 167.64,69.85 180.34,69.85 E14.5 E14.4 | E33.9 54.61,72.39 54.61,76.83 E33.2 | v46.99,112.39 E38.10
(DCM+DPIC+SAM)*TS3  (via drill 0.81)
  Top 0.813: v36.2,87.63 34.92,89.53 34.92,93.98 35.56,95.89 35.56,104.14 38.1,107.95 38.1,117.47 E38.12 | v104.14,83.82 104.14,82.55 E25.2
  Bottom 0.813: E40.3 3.81,41.91 3.81,43.81 8.89,46.99 8.89,52.07 4.45,54.61 4.45,82.55 10.16,87.63 v36.2,87.63 38.1,87 55.24,87 57.78,85.09 87,85.09 90.81,83.82 v104.14,83.82 106.05,85.09 109.86,85.09 113.03,81.92 113.03,75.56 E25.11
+3VA
  Top 0.813: E41.13 16.51,80.64 16.51,83.19 14.61,85.72 E42.8
+3VB
  Top 0.813: E27.14 113.67,167.64 113.67,163.83 E27.11
  Bottom 0.813: E27.11 113.03,163.83 113.03,166.37 111.12,167.64 111.12,172.72 E27.1 104.78,173.35 102.87,173.35 88.27,177.16 85.72,177.16 84.45,175.9 84.45,171.45 E31.14 88.9,168.28 88.9,164.47 E31.11 80.64,154.94 71.12,154.94 66.04,156.21 35.56,156.21 32.38,160.66 32.38,170.81 E39.2 | E27.15 E27.14 116.84,169.54 E24.6
+3VC  (via drill 0.81)
  Top 0.813: v215.26,179.71 216.53,176.53 216.53,168.91 E12.11 E12.10 | v244.47,180.97 247.01,168.28 E4.4 | E16.11 192.41,163.83 192.41,167.64 E16.14 | E5.4 227.97,36.83 227.97,41.27 E5.1
  ECO 0.813: v244.47,180.97 244.47,161.29 241.3,154.31 241.3,86.36 244.47,83.19 244.47,56.52 E1.1
  Bottom 0.813: v244.47,180.97 228.6,180.97 225.43,179.71 v215.26,179.71 211.46,178.44 205.1,178.44 E16.15 E16.14 | E4.4 E4.8 | E1.10 E1.4 E5.10 E5.4 | E16.11 184.15,154.94 177.16,154.94 173.99,158.12 170.81,158.12 170.18,158.12 165.1,154.94 156.21,154.94 153.03,158.75 | 153.03,158.75 E20.6 160.02,164.47 160.02,170.18 E20.2 | E24.11 147.96,158.75 153.03,158.75 | E1.1 E5.13 E5.1
+3VD  (via drill 0.81)
  Top 0.813: E17.10 167.64,34.29 167.64,35.56 | 167.64,35.56 167.64,38.73 E17.13 | E21.10 139.06,34.92 139.06,35.56 | 139.06,35.56 139.06,36.2 E21.12 | v175.26,35.56 167.64,35.56 | E21.4 139.06,35.56
  Bottom 0.813: E21.10 R14.1 R15.2 E17.4 E17.13 | E13.4 v175.26,35.56
AC0  (via drill 0.81)
  Top 0.813: E12.9 219.07,164.47 219.07,176.53 216.53,181.61 v216.53,190.5
  Bottom 0.813: v216.53,190.5 202.56,190.5 198.12,188.59 186.69,188.59 184.47,189.87 179.07,189.87 177.8,189.23 156.21,189.23 154.31,191.77 154.31,194.94 155.57,198.12 155.57,204.47 F.H2
AC0_NE_AC1  (via drill 0.81)
  Top 0.813: E8.1 v228.6,187.96 | v149.86,189.23 151.76,198.75 151.76,204.47 F.F1
  Bottom 0.813: v228.6,187.96 215.26,187.96 209.55,184.78 184.78,184.78 182.88,186.06 180.34,186.06 178.44,185.42 154.31,185.42 v149.86,189.23
AC1  (via drill 0.81)
  Top 0.813: v223.52,121.92 223.52,163.19 225.43,165.1 v225.43,190.5
  Bottom 0.813: E7.2 v223.52,121.92 | v225.43,190.5 218.44,193.04 204.47,193.04 196.85,189.87 187.32,189.87 184.78,191.13 178.75,191.13 177.48,190.5 156.84,190.5 155.57,192.41 155.57,194.31 158.75,198.75 158.75,204.47 F.J2
AC2-8_0  (via drill 0.81)
  Top 0.813: v198.75,121.92 200.03,129.54 200.03,163.19 E12.2 209.55,175.9 209.55,179.71 v207.65,187.32
  Bottom 0.813: v198.75,121.92 190.5,125.73 187.32,125.73 182.25,118.11 E15.3 | F.E2 149.22,205.1 149.22,198.75 151.76,195.58 151.76,190.5 154.94,186.69 178.44,186.69 179.71,187.32 183.51,187.32 185.42,186.06 205.74,186.06 v207.65,187.32
AC2-MQ11_0  (via drill 0.9 pad 0.3)
  Top 0.813: E2.13 260.35,80.01 260.35,143.51 v259.08,150.5
  Bottom 0.813: E12.12 215.26,169.54 229.24,156.84 231.78,156.84 E8.9 v259.08,150.5
AC4-11_0  (via drill 0.81)
  Top 0.813: v180.97,183.51 180.97,196.22 179.71,197.49 176.53,197.49 174.62,198.75 174.62,205.1 F.P1
  Bottom 0.813: E4.1 244.47,185.42 214,185.42 209.55,182.88 203.84,182.88 196.85,179.71 185.42,179.71 v180.97,183.51
AC_0  (via drill 0.81)
  Top 0.813: v171.45,121.28 171.45,123.19 174.62,127.64 174.62,133.99 179.71,140.97 179.71,146.05 177.16,149.22 174.62,153.03 172.09,162.56 172.09,173.35 176.53,179.71 176.53,195.58 174.62,196.85 172.72,196.85 171.45,198.75 171.45,204.47 F.N1
  Bottom 0.813: E15.4 v171.45,121.28
BAC0  (via drill 0.81)
  Top 0.813: E12.8 v215.9,150.5 219.07,147.96 219.07,117.47 218.44,114.94 218.44,102.87 219.07,101.6 219.07,76.2 217.17,73.66 217.17,65.41 214.63,62.87 212.72,62.87 211.46,64.14 211.46,66.04 E10.9 | v126.68,142.24 125.73,130.81 125.73,125.09 128.91,118.11 128.91,116.2 128.27,114.94 128.27,101.6 125.09,95.89 125.09,93.98 129.54,87.63 129.54,84.45 130.81,76.83 E22.3
  Bottom 0.813: v215.9,150.5 211.46,149.22 195.58,149.22 190.5,145.41 181.61,145.41 179.71,147.32 175.9,147.32 172.72,144.15 158.75,144.15 157.48,144.78 141.92,144.78 135.89,141.6 128.91,141.6 v126.68,142.24
BMQ0  (via drill 0.9 pad 0.3)
  Top 0.813: E9.9 217.81,33.66 217.81,44.45 220.98,47.62 220.98,66.67 219.71,68.58 219.71,70.48 v220.98,72.39 | E10.12 216.53,78.11 216.53,100.33 215.26,102.87 215.26,109.22 E11.9
  Bottom 0.813: v220.98,72.39 E10.12
BTP3  (via drill 0.81, 0.9, 0.9 pad 0.3)
  Top 0.813: E9.3 196.85,42.55 196.85,58.42 v198.75,60.33 | E32.12 63.5,35.56 66.04,35.56 69.22,39.37 69.22,48.26 64.14,55.88 64.14,60.96 66.04,62.87 66.04,65.41 71.12,73.66 71.12,77.47 69.85,79.38 69.85,81.28 73.03,87 v73.03,118.11 73.66,120.02 73.66,142.88 71.12,144.78 71.12,176.53 v76.2,179.71 | v146.69,179.07 146.69,147.96 149.86,137.16 149.86,130.18 153.03,125.09 153.03,116.2 v152.4,114.94 149.22,108.58 149.22,104.14 146.05,100.33 142.88,93.34 142.88,90.17 146.05,81.28 146.05,71.12 E22.9
  Bottom 0.813: E36.9 41.27,31.11 42.55,32.38 44.45,38.73 E32.2 E32.12 | E6.5 226.06,66.67 217.81,64.14 212.09,60.33 v198.75,60.33 197.49,59.69 188.59,59.69 186.69,57.78 180.97,57.78 177.16,63.5 172.09,63.5 168.28,59.69 162.88,59.69 145.41,67.94 E22.9 | E30.3 v73.03,118.11 | v76.2,179.71 83.19,184.15 94.61,184.15 97.16,185.74 110.49,185.74 112.39,182.88 117.47,182.88 126.36,179.07 136.84,179.07 139.38,180.34 144.78,180.34 v146.69,179.07 149.22,177.8 167,177.8 168.91,175.9 180.34,175.9 E16.1 | v152.4,114.94 E19.3
C0  (via drill 0.9 pad 0.3)
  Top 0.813: U$2.CE1 114.94,8.26 v114.94,49.53 | v146.05,50.16 145.41,51.44 145.41,62.87 150.5,68.58 v150.5,72.39
  Bottom 0.813: v114.94,49.53 118.11,48.26 124.46,48.26 126.36,50.16 v146.05,50.16 | v150.5,72.39 E18.1
CARRY_IN  (via drill 0.9 pad 0.3)
  Top 0.813: v116.84,87 117.47,86.36 117.47,80.01 E25.13 | F.S1 180.97,204.47 180.97,198.75 182.25,196.85 182.25,189.87 183.51,187.32 183.51,182.25 182.25,180.97 180.34,180.97 178.44,180.34 173.35,172.72 173.35,163.83 175.9,153.67 180.97,146.69 180.97,139.7 175.9,133.35 175.9,127 173.99,124.46 173.99,118.75 168.28,110.49 168.28,102.87 175.26,95.25 175.26,87 172.09,80.01 172.09,74.3 v171.45,72.39
  Bottom 0.813: v116.84,87 124.46,78.11 128.91,78.11 132.72,83.19 133.99,83.19 E22.13 147.32,81.28 151.76,81.28 156.84,84.45 160.34,84.45 163.19,78.74 E18.13 168.91,76.83 v171.45,72.39
CLOCK  (via drill 0.9)
  Top 0.813: v66.04,43.81 66.04,50.8 62.87,55.24 62.87,62.23 64.77,64.14 64.77,66.67 66.67,69.85 66.67,74.3 65.41,75.56 65.41,78.74 69.85,87.63 69.85,116.2 69.22,116.84 69.22,119.38 71.12,121.92 71.12,141.6 68.58,143.51 68.58,178.44 79.38,190.5 83.19,198.75 83.19,205.1 H.D1
  Bottom 0.813: E28.1 v66.04,43.81
DAD+DST  (via drill 0.81)
  Top 0.813: H.H1 92.71,203.2 92.71,198.75 90.81,197.49 90.81,191.77 93.98,187.96 93.98,181.61 90.81,173.35 90.81,147.32 89.53,142.88 89.53,133.99 v92.08,130.81
  Bottom 0.813: v92.08,130.81 94.61,132.08 99.06,132.08 104.14,127 124.46,127 127.64,129.54 137.16,129.54 141.29,131.44 147.96,131.44 153.03,135.25 180.34,135.25 186.06,130.18 226.69,130.18 241.94,125.09 241.94,114.3 E7.9
DATA1  (via drill 0.9 pad 0.3)
  Top 0.813: U$2.AS1 216.53,10.16 216.53,14.61 220.98,30.48 220.98,43.81 224.79,47.62 v224.79,50.16 224.79,59.69 223.52,60.96 223.52,66.04 224.79,67.31 224.79,70.48 221.62,75.56 221.62,102.87 220.98,104.14 220.98,113.67 221.62,115.57 221.62,127 222.25,130.18 v222.25,182.88
  Bottom 0.813: v224.79,50.16 222.88,51.44 215.9,51.44 215.26,50.8 200.66,50.8 199.39,50.16 176.53,50.16 173.99,52.7 161.29,52.7 151.76,57.15 146.05,57.15 142.24,53.98 124.46,53.98 122.56,52.07 120.65,52.07 118.11,53.98 112.39,53.98 111.12,52.7 102.87,52.7 92.08,59.05 76.2,59.05 68.58,55.88 65.41,55.88 63.5,57.78 57.15,57.78 53.34,59.69 47.62,59.69 43.18,65.41 41.27,65.41 E37.10 | E16.5 186.06,166.37 186.06,175.26 188.59,178.44 197.49,178.44 204.47,181.61 210.19,181.61 215.26,184.15 220.98,184.15 v222.25,182.88
DATA_F  (via drill 0.81, 0.9 pad 0.3)
  Top 0.813: v174.62,194.94 174.62,179.71 170.81,173.99 170.81,156.84 v172.09,154.31 | E27.4 104.14,163.83 104.14,143.51 102.23,139.7 102.23,130.81 102.87,128.91 102.87,114.94 101.6,112.39 101.6,102.87 97.79,95.25 97.79,78.74 v99.69,76.83
  Bottom 0.813: E27.4 111.12,165.74 111.12,163.19 113.03,161.29 113.03,156.21 115.57,154.31 123.83,154.31 133.35,149.22 133.99,149.22 139.7,152.4 145.41,152.4 149.22,154.31 153.03,154.31 154.94,152.4 166.69,152.4 169.23,154.31 v172.09,154.31 | F.N2 171.45,203.84 171.45,198.75 v174.62,194.94 | E25.1 v99.69,76.83
DATA_T  (via drill 0.9 pad 0.3)
  Top 0.813: v177.16,172.09 179.71,177.8 181.61,178.44 184.15,178.44 186.06,180.97 v186.06,192.41
  Bottom 0.813: E20.13 v177.16,172.09 | v186.06,192.41 187.32,194.31 187.32,205.1 F.U2
DIV_12_L
  Top 0.813: H.N1 108.58,205.1 108.58,199.39 116.84,189.87 116.84,180.34 120.02,175.9 120.02,163.83 E27.10
DVI  (via drill 0.81, 0.9 pad 0.3)
  Top 0.813: E22.6 v127,62.23 | E33.1 51.44,89.53 51.44,106.05 v48.9,109.86 | E15.1 179.07,121.28 179.07,106.05 180.34,100.33 180.34,84.45 177.16,77.47 177.16,68.58 175.9,67.31 v175.9,61.59 174.62,59.69 174.62,55.88 181.61,46.99 E13.1
  Bottom 0.813: E33.1 56.52,78.11 56.52,75.56 E33.11 65.41,73.66 72.39,66.67 74.93,66.67 77.47,64.14 87.63,64.14 88.27,64.77 100.33,64.77 106.68,60.96 118.75,60.96 120.02,62.23 v127,62.23 128.27,62.23 130.81,59.69 136.53,59.69 140.97,63.5 151.76,63.5 162.56,58.42 168.91,58.42 172.09,61.59 v175.9,61.59 | E38.9 v48.9,109.86 50.16,114.94 E34.4
DVI*TS3  (via drill 0.9 pad 0.3)
  Top 0.813: v127.64,95.25 129.54,97.16 129.54,114.3 130.18,115.57 130.18,118.75 127,125.73 127,129.54 130.81,149.86 130.81,158.12 132.72,159.38 E24.7
  Bottom 0.813: E38.8 41.27,108.58 50.8,102.23 69.85,102.23 71.75,100.97 86.36,100.97 90.81,98.42 122.87,98.42 v127.64,95.25
E  (via drill 0.81)
  Top 0.813: v45.09,22.23 41.91,34.92 38.1,40.01 38.1,53.34 39.37,56.52 39.37,67.31 v41.27,69.85 | v74.3,60.33 77.47,61.59 E29.7
  Bottom 0.813: U$2.DL2 29.21,9.53 29.21,14.61 32.38,18.41 41.91,18.41 v45.09,22.23 | v41.27,69.85 48.9,60.96 53.98,60.96 57.78,59.05 64.14,59.05 66.67,57.15 67.94,57.15 v74.3,60.33
EAE_ON  (via drill 0.81, 0.9 pad 0.3)
  Top 0.813: E14.9 191.13,66.67 191.13,64.77 190.5,63.5 190.5,57.15 v189.87,55.88 | v127,56.52 128.27,55.24 v128.27,36.83 | v44.45,60.33 44.45,50.16 47.62,46.99 47.62,29.21 v54.61,23.5 | E26.2 105.41,119.38 105.41,113.67 104.14,111.12 104.14,101.6 100.33,93.98 100.33,81.92 104.14,76.83 104.14,60.96 v102.87,55.24 101.6,48.26 101.6,41.91 106.05,37.47 106.05,33.02 102.23,29.21 102.23,25.4 v104.14,22.23 | E1.13 253.37,41.91 260.35,59.05 260.35,66.04 E2.9
  Bottom 0.813: E2.9 254.63,67.94 | 254.63,67.94 254.63,70.48 E2.4 | 254.63,67.94 254.63,64.14 251.46,60.96 239.4,60.96 237.49,59.05 227.33,59.05 225.43,57.78 202.56,57.78 200.66,55.88 v189.87,55.88 187.96,54.61 161.29,54.61 151.76,59.05 146.05,59.05 142.24,55.88 128.27,55.88 v127,56.52 125.09,56.52 122.56,53.98 120.65,53.98 118.75,55.24 111.76,55.24 110.49,54.61 104.78,54.61 v102.87,55.24 | v128.27,36.83 E21.5 | E37.3 32.38,74.3 32.38,64.77 35.56,62.87 40.01,62.87 v44.45,60.33 | v104.14,22.23 101.6,25.4 90.81,25.4 87.63,22.86 83.19,22.86 78.74,24.13 75.56,26.67 64.77,26.67 62.23,23.5 v54.61,23.5
EIR2  (via drill 0.81)
  Top 0.813: v99.06,193.68 99.06,179.07 97.79,173.35 97.79,150.5 95.89,148.59 95.89,128.91 97.16,125.73 v97.16,120.02 | E26.5 105.41,110.49 105.41,100.33 101.6,93.34 101.6,83.19 107.31,76.2 E25.3
  Bottom 0.813: H.T2 121.28,203.84 121.28,198.75 118.75,195.58 101.6,195.58 v99.06,193.68 | v97.16,120.02 E26.5
EIR3  (via drill 0.81)
  Top 0.813: v177.16,164.47 177.8,162.56 178.44,154.94 183.51,148.59 183.51,138.43 v179.71,132.08 | v123.83,121.92 122.56,127 119.38,133.35 119.38,147.96 123.83,160.02 123.83,177.8 121.28,181.61 121.28,193.68 118.11,198.75 118.11,204.47 H.S1
  Bottom 0.813: v177.16,164.47 E20.11 162.56,163.83 162.56,169.54 | 162.56,169.54 162.56,172.72 E20.1 | E20.14 162.56,169.54 | v179.71,132.08 173.99,133.99 153.67,133.99 148.59,130.18 142.24,130.18 141.6,130.18 137.79,128.27 128.27,128.27 125.09,125.73 123.83,125.73 | 123.83,125.73 112.39,125.73 110.49,123.83 110.49,118.11 E26.4 | 123.83,125.73 v123.83,121.92
EN0  (via drill 0.9 pad 0.3)
  Top 0.813: E25.10 118.75,74.93 118.75,87.63 116.84,91.44 116.84,102.23 120.02,111.12 v120.02,113.67 | v184.15,195.58 184.15,189.23 184.78,187.96 184.78,181.61 183.51,179.71 180.97,179.71 179.07,179.07 174.62,172.09 174.62,164.47 177.16,154.31 182.25,147.96 182.25,139.06 177.16,132.72 177.16,126.36 175.26,123.83 175.26,115.57 173.35,112.39 v173.35,104.14
  Bottom 0.813: v120.02,113.67 124.46,113.67 132.72,106.05 135.89,106.05 137.79,107.95 137.79,111.12 E23.10 144.15,110.49 156.21,102.23 160.66,102.23 165.1,106.05 171.45,106.05 v173.35,104.14 | F.T2 184.15,205.1 v184.15,195.58
EN1  (via drill 0.9 pad 0.3)
  Top 0.813: v106.68,182.88 107.31,178.44 109.86,175.9 109.86,171.45 E27.3 | E20.3 154.94,171.45 154.94,175.9 158.12,181.61 158.75,187.32 v159.38,194.94
  Bottom 0.813: E20.3 142.24,177.8 140.34,177.8 137.79,176.53 125.73,176.53 116.84,180.34 110.49,180.34 v106.68,182.88 97.79,182.88 92.08,179.71 88.9,179.71 88.27,180.34 82.55,180.34 81.28,179.07 81.28,168.91 E31.4 | v159.38,194.94 162.56,193.04 175.9,193.04 177.16,194.31 177.16,196.22 174.62,198.75 174.62,205.1 F.P2
EN2  (via drill 0.81)
  Top 0.813: v193.68,104.14 193.68,117.47 192.41,121.28 193.68,131.44 196.85,139.06 196.85,167 v198.12,169.54 198.12,177.8 v193.68,191.77
  Bottom 0.813: E16.13 v198.12,169.54 | v193.68,104.14 193.04,104.78 177.8,104.78 173.99,107.31 170.81,107.31 E19.9 | v193.68,191.77 191.13,193.04 190.5,198.12 190.5,205.1 F.V2
ETP  (via drill 0.81)
  Top 0.813: E12.4 201.29,162.56 201.29,129.54 200.66,125.09 200.66,118.75 199.39,115.57 v199.39,101.6 200.03,98.42 200.03,83.19 200.66,81.28 200.66,58.42 198.12,56.52 198.12,45.09 E9.2
  Bottom 0.813: E12.4 E12.3 | v199.39,101.6 194.31,101.6 191.13,103.5 180.97,103.5 177.16,102.23 162.56,102.23 161.29,100.97 155.57,100.97 141.6,110.49 E23.9 | E9.2 208.28,40.64 | 208.28,40.64 208.28,44.45 207.01,45.72 204.47,45.72 E13.11 | E9.13 208.28,40.64
ETP+TP3  (via drill 0.81)
  Top 0.813: v22.86,142.88 21.59,137.16 21.59,116.84 19.68,101.6 19.68,90.81 20.95,88.9 20.95,75.56 16.51,71.12 16.51,56.52 20.95,48.26 v20.95,34.92
  Bottom 0.813: E43.12 15.24,168.28 15.24,152.4 v22.86,142.88 | v20.95,34.92 27.3,45.72 73.66,45.72 74.3,45.09 77.47,45.09 78.11,45.72 88.9,45.72 91.44,40.64 94.61,40.64 95.25,41.27 97.79,41.27 100.33,38.1 100.33,34.92 100.97,34.29 122.56,34.29 123.83,35.56 125.09,35.56 127,38.1 129.54,39.37 E21.3 134.62,38.1 136.53,33.66 136.53,26.04 140.34,22.86 144.15,22.86 146.05,24.13 151.13,24.13 154.31,21.59 164.47,21.59 172.72,27.3 175.26,27.3 179.07,22.86 183.51,22.86 187.32,26.04 190.5,26.04 E9.1
FD_SET  (via drill 0.81)
  Top 0.813: v107.95,193.04 v113.67,184.78 | v168.91,178.44 168.28,179.71 168.28,196.22 165.1,198.75 165.1,204.47 F.L1
  Bottom 0.813: H.U2 124.46,203.2 124.46,198.75 120.65,193.04 v107.95,193.04 | v113.67,184.78 117.79,184.15 127,180.34 136.53,180.34 139.06,181.61 147.32,181.61 150.5,179.07 167.64,179.07 v168.91,178.44
FE_SET  (via drill 0.81)
  Top 0.813: H.V1 127.64,203.84 127.64,198.75 125.73,194.94 125.73,186.06 v127,182.88 | v170.81,179.71 169.54,182.25 169.54,196.85 168.28,198.12 168.28,205.1 F.M1
  Bottom 0.813: v127,182.88 129.54,182.25 137.16,182.25 138.43,182.88 148.59,182.88 151.76,180.34 170.18,180.34 v170.81,179.71
FETCH  (via drill 0.81)
  Top 0.813: E3.4 248.28,113.67 248.28,99.06 249.56,95.89 v249.56,90.17 | v41.91,99.06 41.27,96.52 41.27,73.03 43.18,71.12 43.18,67.94 40.64,65.41 40.64,47.62 42.55,45.09 42.55,40.01 43.81,33.02 v48.26,22.23
  Bottom 0.813: v249.56,90.17 246.38,91.44 201.93,91.44 198.75,89.53 172.72,89.53 170.81,91.44 155.26,91.44 152.4,89.85 151.76,90.17 149.86,90.17 147.96,88.9 137.16,88.9 135.25,90.17 130.81,90.17 128.91,88.9 123.19,88.9 120.02,92.71 73.03,92.71 66.04,97.16 46.35,97.16 v41.91,99.06 | v48.26,22.23 44.45,16.51 36.83,16.51 35.56,15.24 35.56,8.89 U$2.DJ2
GND  (via drill 0.81, 0.9 pad 0.3)
  Top 0.813: U$2.DN1 23.5,7.94 23.5,19.05 | 23.5,19.05 10.16,19.05 | U$2.DT1 10.16,7.94 10.16,8.89 10.79,8.89 10.79,15.24 10.16,19.05 | 10.16,19.05 E40.7 4.45,30.48 4.45,41.91 E40.1 11.43,46.35 11.43,52.7 C30.2 | 23.5,19.05 28.57,19.05 | 28.57,19.05 E36.7 | U$2.DC1 51.44,9.53 51.44,15.24 54.61,19.05 | 54.61,19.05 42.55,19.05 | 42.55,19.05 28.57,19.05 | U$2.DF1 42.55,8.26 42.55,19.05 | E32.7 57.78,28.57 | 57.78,28.57 57.78,22.23 54.61,19.05 | E30.4 76.83,114.3 76.83,104.78 C22.2 E29.1 80.64,79.38 80.64,72.39 E29.5 84.45,65.41 84.45,55.24 C21.2 81.28,45.72 81.28,31.11 E28.7 78.74,25.4 92.71,14.61 92.71,9.53 U$2.CN1 | 252.73,113.03 252.73,104.78 C3.2 252.09,97.79 252.09,67.31 E2.7 C2.2 245.75,29.84 E1.7 C1.2 | 252.73,113.03 252.73,120.65 E3.1 C4.2 E4.7 252.09,161.29 252.09,167.64 E4.3 | E3.5 252.73,113.03 | E12.7 C12.2 208.28,142.24 208.28,129.54 207.65,123.83 207.65,107.95 | U$2.AF1 245.11,8.89 245.11,15.24 239.4,17.14 C5.2 | C5.2 E5.7 232.41,30.48 232.41,43.18 C6.2 E6.7 233.04,67.94 233.04,83.19 234.31,85.72 234.31,92.71 C7.2 232.41,104.14 232.41,107.95 | U$2.AN1 226.06,8.26 226.06,18.41 C5.2 | U$2.AT1 213.36,8.26 213.36,15.24 C9.2 | C9.2 199.39,21.59 195.58,18.41 187.96,18.41 | 187.96,18.41 C13.2 E13.7 183.51,29.84 183.51,50.16 C14.2 184.15,55.24 184.15,59.05 185.42,60.33 185.42,62.23 E14.7 184.15,67.94 184.15,97.79 C15.2 E15.7 183.51,109.86 183.51,123.83 C16.2 186.69,150.5 E16.8 | U$2.BC2 184.78,8.89 184.78,18.41 | 184.78,18.41 187.96,18.41 | U$2.BF2 175.26,8.26 175.26,18.41 | 175.26,18.41 184.78,18.41 | U$2.BT1 143.51,8.26 143.51,16.51 | 143.51,16.51 151.13,16.51 153.03,18.41 156.21,18.41
  Top 0.813: 156.21,18.41 172.72,18.41 | 172.72,18.41 175.26,18.41 | C34.- 172.72,18.41 | U$2.BN1 156.21,8.26 156.21,18.41 | U$2.CC2 121.28,8.26 121.28,19.68 | 121.28,19.68 127.64,19.68 130.81,21.59 136.53,21.59 143.51,16.51 | C35.- 121.28,19.68 | 135.25,65.41 135.25,86.36 133.35,88.27 E23.7 135.25,109.86 135.25,125.09 133.35,127.64 E24.8 | 135.25,65.41 E22.7 | 135.25,65.41 135.25,50.16 130.81,44.45 130.81,29.84 E21.7 144.15,19.68 149.86,19.68 156.84,26.04 E17.7 154.94,29.84 154.94,38.73 R15.1 152.4,52.7 153.67,53.98 157.48,53.98 | C27.2 28.57,59.05 E37.7 32.38,69.22 32.38,82.55 30.48,88.27 30.48,96.52 C28.2 E38.7 31.75,111.12 31.75,128.27 C29.2 32.38,144.15 32.38,160.02 | C31.2 9.53,93.34 | 9.53,93.34 9.53,108.58 | 9.53,108.58 C32.2 | E42.7 9.53,108.58 | E41.7 8.89,67.94 8.89,87 9.53,93.34 | C18.2 107.31,31.11 107.31,45.09 | 107.31,45.09 107.31,52.7 109.86,58.42 109.86,66.04 | 109.86,66.04 E25.7 | C19.2 107.31,45.09 | 109.86,66.04 109.86,82.55 107.95,85.09 E26.7 109.86,110.49 109.86,126.36 C20.2 107.95,140.97 E27.8 | E19.7 159.38,108.58 | 159.38,108.58 159.38,67.31 E18.7 157.48,53.98 | C17.2 157.48,53.98 | 207.65,107.95 207.65,104.78 C11.2 207.65,86.36 207.65,67.31 E10.7 C10.2 209.55,44.45 209.55,31.11 E9.7 C9.2 | E11.7 207.65,107.95 | 232.41,107.95 232.41,134.62 C8.2 E8.7 231.78,161.29 231.78,168.28 E8.3 E8.2 | E7.7 232.41,107.95 | v95.89,155.57 95.89,173.35 97.79,180.34 97.79,190.5 v96.52,193.68 | 57.78,28.57 57.78,43.81 49.53,52.7 C24.2 E33.7 54.61,67.94 54.61,89.53 C25.2 53.34,106.05 E34.7 55.88,112.39 55.88,135.25 C26.2 53.98,142.24 53.98,157.48 E35.7 | F.K1 161.29,204.47 161.29,198.75 159.38,175.9 159.38,164.47
  Top 0.813: 159.38,164.47 159.38,158.75 E20.8 159.38,153.03 159.38,108.58 | E20.5 159.38,164.47 | E39.7 32.38,160.02 | 32.38,160.02 32.38,173.35 E39.1 | E31.6 80.64,160.66 80.64,157.48 | 80.64,157.48 80.64,141.6 C23.2 81.28,137.16 81.28,130.81 78.74,128.27 E30.1 | E31.8 80.64,157.48 | E24.15 142.88,173.99 142.88,175.26 v133.35,187.96 | E20.15 162.56,170.18 162.56,161.29 E20.10
  Bottom 0.813: E30.1 81.28,121.92 81.28,118.11 E30.4 | E4.7 251.46,159.38 256.54,156.21 259.08,156.21 260.99,158.12 260.99,160.66 E4.9 | U$2.AF1 245.11,8.89 245.11,19.05 | 245.11,19.05 C1.2 | U$2.AC2 254.63,8.89 254.63,19.05 | 254.63,19.05 C33.- | 254.63,19.05 245.11,19.05 | C9.2 213.36,18.41 | 213.36,18.41 226.06,18.41 | 226.06,18.41 C5.2 234.95,19.05 245.11,19.05 | U$2.AT1 213.36,8.89 213.36,18.41 | U$2.AN1 226.06,8.89 226.06,18.41 | U$2.BC2 184.78,8.89 184.78,18.41 | 184.78,18.41 C13.2 | U$2.BF2 175.26,8.26 175.26,18.41 | 175.26,18.41 184.78,18.41 | C34.- 175.26,18.41 | U$2.CC2 121.28,8.26 121.28,19.68 C35.- 119.38,24.77 106.05,24.77 C18.2 89.53,26.67 88.9,26.04 85.72,26.04 83.82,28.57 E28.7 74.93,30.48 64.14,30.48 60.96,26.04 57.78,26.04 E32.7 | E40.10 11.43,34.92 11.43,40.64 E40.1 | E42.9 E42.7 | E41.7 C30.2 10.79,52.7 15.24,52.7 C27.2 32.38,53.98 38.1,53.98 C24.2 | E20.8 E20.10 170.81,160.66 176.53,160.66 E16.8 | E27.8 v95.89,155.57 | v96.52,193.68 96.52,198.12 | 96.52,198.12 96.52,205.1 H.J2 | 96.52,198.12 99.06,198.12 | 99.06,198.12 102.23,198.12 | 102.23,198.12 105.41,198.12 | 105.41,198.12 108.58,198.12 | 108.58,198.12 111.76,198.12 | 111.76,198.12 114.94,198.12 | 114.94,198.12 118.11,198.12 118.11,205.1 H.S2 | H.K2 99.06,205.1 99.06,198.12 | H.L2 102.23,204.47 102.23,198.12 | H.M2 105.41,205.1 105.41,198.12 | H.N2 108.58,205.1 108.58,198.12 | H.R2 114.94,205.1 114.94,198.12 | H.P2 111.76,205.1 111.76,198.12 | E24.15 152.4,165.74 E20.5 | E43.7 C32.2 | E29.5 E29.9 | E31.2 76.83,170.81 76.83,164.47 E31.6 | F.D2 146.05,203.84 146.05,198.12 | 146.05,198.12 142.24,198.12 142.24,205.1 F.C2 | v133.35,187.96 144.78,187.96 149.86,191.13 149.86,194.94 146.05,198.12
GTF+IND
  Top 0.813: H.A1 73.66,205.1 73.66,198.75 73.03,191.13 70.48,188.59 55.24,188.59 49.53,182.88 49.53,180.97 40.64,171.45 40.64,151.13 41.27,149.86 41.27,144.78 40.64,142.88 40.64,130.18 42.55,127.64 42.55,118.11 40.64,115.57 40.64,106.05 41.91,104.78 41.91,101.6 40.01,99.69 40.01,72.39 E37.9
INCR_SC  (via drill 0.9 pad 0.3)
  Top 0.813: H.K1 99.06,205.1 99.06,198.75 93.98,195.58 93.98,193.04 96.52,189.23 96.52,180.34 93.34,172.09 v93.34,138.43 | v27.3,135.89 30.48,125.73 30.48,120.65 E38.3
  Bottom 0.813: v93.34,138.43 83.82,138.43 82.55,136.53 50.16,136.53 47.62,137.79 41.91,137.79 38.73,135.89 v27.3,135.89
INIT  (via drill 0.81)
  Top 0.813: v78.74,22.23 86.36,14.61 86.36,8.89 U$2.CR1
  Bottom 0.813: E40.6 9.53,29.21 11.43,24.77 19.68,24.77 29.84,21.59 38.73,21.59 43.18,25.4 50.16,25.4 53.34,20.95 62.23,20.95 65.41,25.4 74.93,25.4 v78.74,22.23
LAST_STEP_L  (via drill 0.9)
  Top 0.813: H.C1 80.01,203.84 80.01,198.75 78.11,191.13 67.31,179.07 67.31,151.76 64.77,149.22 64.77,147.32 66.04,146.05 66.04,141.6 67.94,140.34 R9.1 66.67,121.92 66.67,117.47 64.77,116.2 64.77,93.98 v66.04,92.08 62.23,83.19 62.23,71.12 | v66.67,40.64 64.14,41.91 64.14,45.72 62.23,47.62 62.23,53.98 61.59,54.61 61.59,62.87 63.5,64.77 63.5,68.58 62.23,69.85 62.23,71.12 | E33.10 62.23,71.12
  Bottom 0.813: E28.3 v66.67,40.64 | v66.04,92.08 69.85,90.17 88.9,90.17 92.08,88.9 99.69,88.9 102.23,90.17 118.11,90.17 121.28,83.82 124.46,80.01 128.27,80.01 132.08,84.45 134.62,84.45 136.21,83.19 152.4,83.19 156.21,85.72 161.93,85.72 174.62,78.11 E14.2 187.96,83.19 190.5,83.19 194.31,82.55 197.49,82.55 E10.1
LINK  (via drill 0.9 pad 0.3)
  Top 0.813: v198.12,23.5 194.31,27.94 194.31,61.59 198.12,64.77 198.12,80.64 196.85,83.19 v196.85,95.89
  Bottom 0.813: U$2.AV2 207.01,10.16 207.01,19.68 204.47,23.5 v198.12,23.5 | v196.85,95.89 200.66,97.16 219.71,97.16 231.14,103.5 250.82,103.5 254,106.68 254,109.22 E3.6
LINK_DATA  (via drill 0.81)
  Top 0.813: E23.4 130.81,113.03 130.81,86.36 E22.1 | v92.71,22.23 94.61,32.38 v94.61,34.92 | v125.09,33.02 123.83,36.83 123.83,38.73 125.09,40.64 125.09,45.09 123.19,46.35 123.19,64.77 132.08,73.03 E22.4
  Bottom 0.813: U$2.CR2 86.36,9.53 86.36,16.51 v92.71,22.23 | v94.61,34.92 98.42,34.92 100.33,33.02 v125.09,33.02 | E22.4 135.25,74.93 135.25,78.74 E22.1
LINK_LOAD  (via drill 0.81)
  Top 0.813: E32.10 62.87,32.38 v67.31,22.23
  Bottom 0.813: E32.1 E32.13 62.23,39.37 62.23,34.92 E32.10 E32.4 | v67.31,22.23 71.75,22.23 78.74,17.78 83.19,14.61 83.19,8.26 U$2.CS2
MD_DISABLE  (via drill 0.9 pad 0.3)
  Top 0.813: v177.16,167.64 179.71,172.09 179.71,173.99 180.97,176.53 182.88,177.16 185.42,177.16 187.96,181.61 187.96,193.68 184.15,198.75 184.15,204.47 F.T1
  Bottom 0.813: E20.12 v177.16,167.64
MODEB  (via drill 0.81)  (1 unrouted)
  Top 0.813: H.R1 114.94,203.84 114.94,198.75 120.02,191.13 120.02,180.97 122.56,177.16 122.56,160.66 118.11,148.59 118.11,132.08 121.28,126.36 121.28,120.65 123.19,118.75 123.19,113.67 124.46,111.12 124.46,104.14 121.28,98.42 121.28,92.08 v123.83,86.36 | v149.86,88.27 154.94,77.47 E18.3 | v224.16,87.63 224.16,101.6 222.25,104.78 222.25,109.86 226.06,114.94 226.06,129.54 224.79,132.72 224.79,161.93 E8.4 | v70.48,191.77 69.22,189.87 55.24,189.87 49.53,194.31 27.94,194.31 26.67,193.04 26.67,180.34 24.77,178.44 24.77,149.22 20.32,144.15 20.32,116.84 18.41,102.87 18.41,90.17 19.68,87.63 19.68,76.2 E41.10
  Bottom 0.813: v123.83,86.36 127.32,86.36 131.44,88.9 134.94,88.9 136.84,87.63 148.59,87.63 v149.86,88.27 152.4,88.27 155.57,90.17 163.19,90.17 170.18,86.36 199.39,86.36 202.88,88.9 220.98,88.9 v224.16,87.63 | H.A2 73.66,205.1 73.66,193.04 v70.48,191.77
MQ0_GT_AC0  (via drill 0.9 pad 0.3)
  Top 0.813: v219.71,182.25 220.34,177.16 220.34,116.2 219.71,114.3 219.71,103.5 220.34,102.23 220.34,75.56 218.44,73.03 218.44,67.94 219.71,66.04 219.71,48.26 216.53,45.72 216.53,34.92 E9.10
  Bottom 0.813: E16.6 187.32,164.47 187.32,174.62 189.23,177.16 198.75,177.16 205.74,180.34 210.82,180.34 214.63,182.25 v219.71,182.25
MQ_0  (via drill 0.81)
  Top 0.813: E12.1 v203.2,187.96
  Bottom 0.813: v203.2,187.96 201.29,187.32 186.06,187.32 184.15,188.59 179.39,188.59 178.12,187.96 155.57,187.96 153.03,191.13 153.03,198.12 152.4,198.75 152.4,204.47 F.F2
MQ_GE_AC  (via drill 0.81)
  Top 0.813: E9.4 195.58,40.64 195.58,60.33 199.39,64.14 199.39,81.28 198.75,82.55 198.75,97.16 196.85,100.33 196.85,102.23 197.49,104.14 197.49,116.84 196.22,120.02 196.22,123.19 198.75,129.54 v198.75,165.1
  Bottom 0.813: v198.75,165.1 E16.10
MQ_LOAD  (via drill 0.81)
  Top 0.813: v178.44,182.25 178.44,193.68 v179.07,194.94
  Bottom 0.813: E43.11 19.68,169.54 19.68,175.9 16.51,179.07 16.51,186.06 19.68,187.96 31.11,187.96 33.02,186.69 33.02,181.61 34.29,179.71 62.23,179.71 64.77,177.16 71.12,177.16 73.66,181.61 81.92,186.69 89.53,186.69 91.12,188.28 125.73,188.28 131.44,184.78 135.89,184.78 137.16,185.42 149.86,185.42 153.03,182.88 175.26,182.88 v178.44,182.25 | v179.07,194.94 178.44,196.22 177.8,198.75 177.8,205.1 F.R2
MSIR_DISABLE  (via drill 0.81)
  Top 0.813: U$2.CV1 73.66,8.26 73.66,20.95 70.48,23.5 70.48,48.9 65.41,56.52 65.41,60.33 67.94,62.87 67.94,66.04 72.39,73.03 72.39,79.38 v71.75,80.01
  Bottom 0.813: v71.75,80.01 E29.4
N$1  (via drill 0.9 pad 0.3)
  Top 0.813: E34.12 62.87,121.28 62.87,127 62.23,127.64 62.23,140.34 v61.59,141.6 | v102.23,144.15 102.87,146.69 102.87,166.37 E27.2 | v206.38,137.79 207.01,135.25 207.01,132.72 E11.1
  Bottom 0.813: E42.12 10.79,120.65 10.79,124.46 28.57,141.6 v61.59,141.6 76.2,141.6 77.47,142.88 100.33,142.88 v102.23,144.15 107.31,144.15 120.02,136.53 137.16,136.53 143.51,139.7 154.94,139.7 156.21,139.06 182.88,139.06 186.06,135.89 198.12,135.89 v206.38,137.79 | E31.15 87.63,172.09 E27.2
N$2  (via drill 0.9 pad 0.3)
  Top 0.813: E29.14 88.27,80.01 88.27,78.11 88.27,77.47 93.34,66.67 v93.34,44.45
  Bottom 0.813: v93.34,44.45 98.42,44.45 102.23,40.01 106.68,40.01 107.95,39.37 122.56,39.37 123.83,41.27 129.54,45.09 135.25,45.09 137.79,41.91 139.7,36.83 E21.11
N$3  (via drill 0.81)